# EAGLE design Main_Board (EAGLE 7.7.0)

## Sheet 1 of 5: Ethernet&CAN
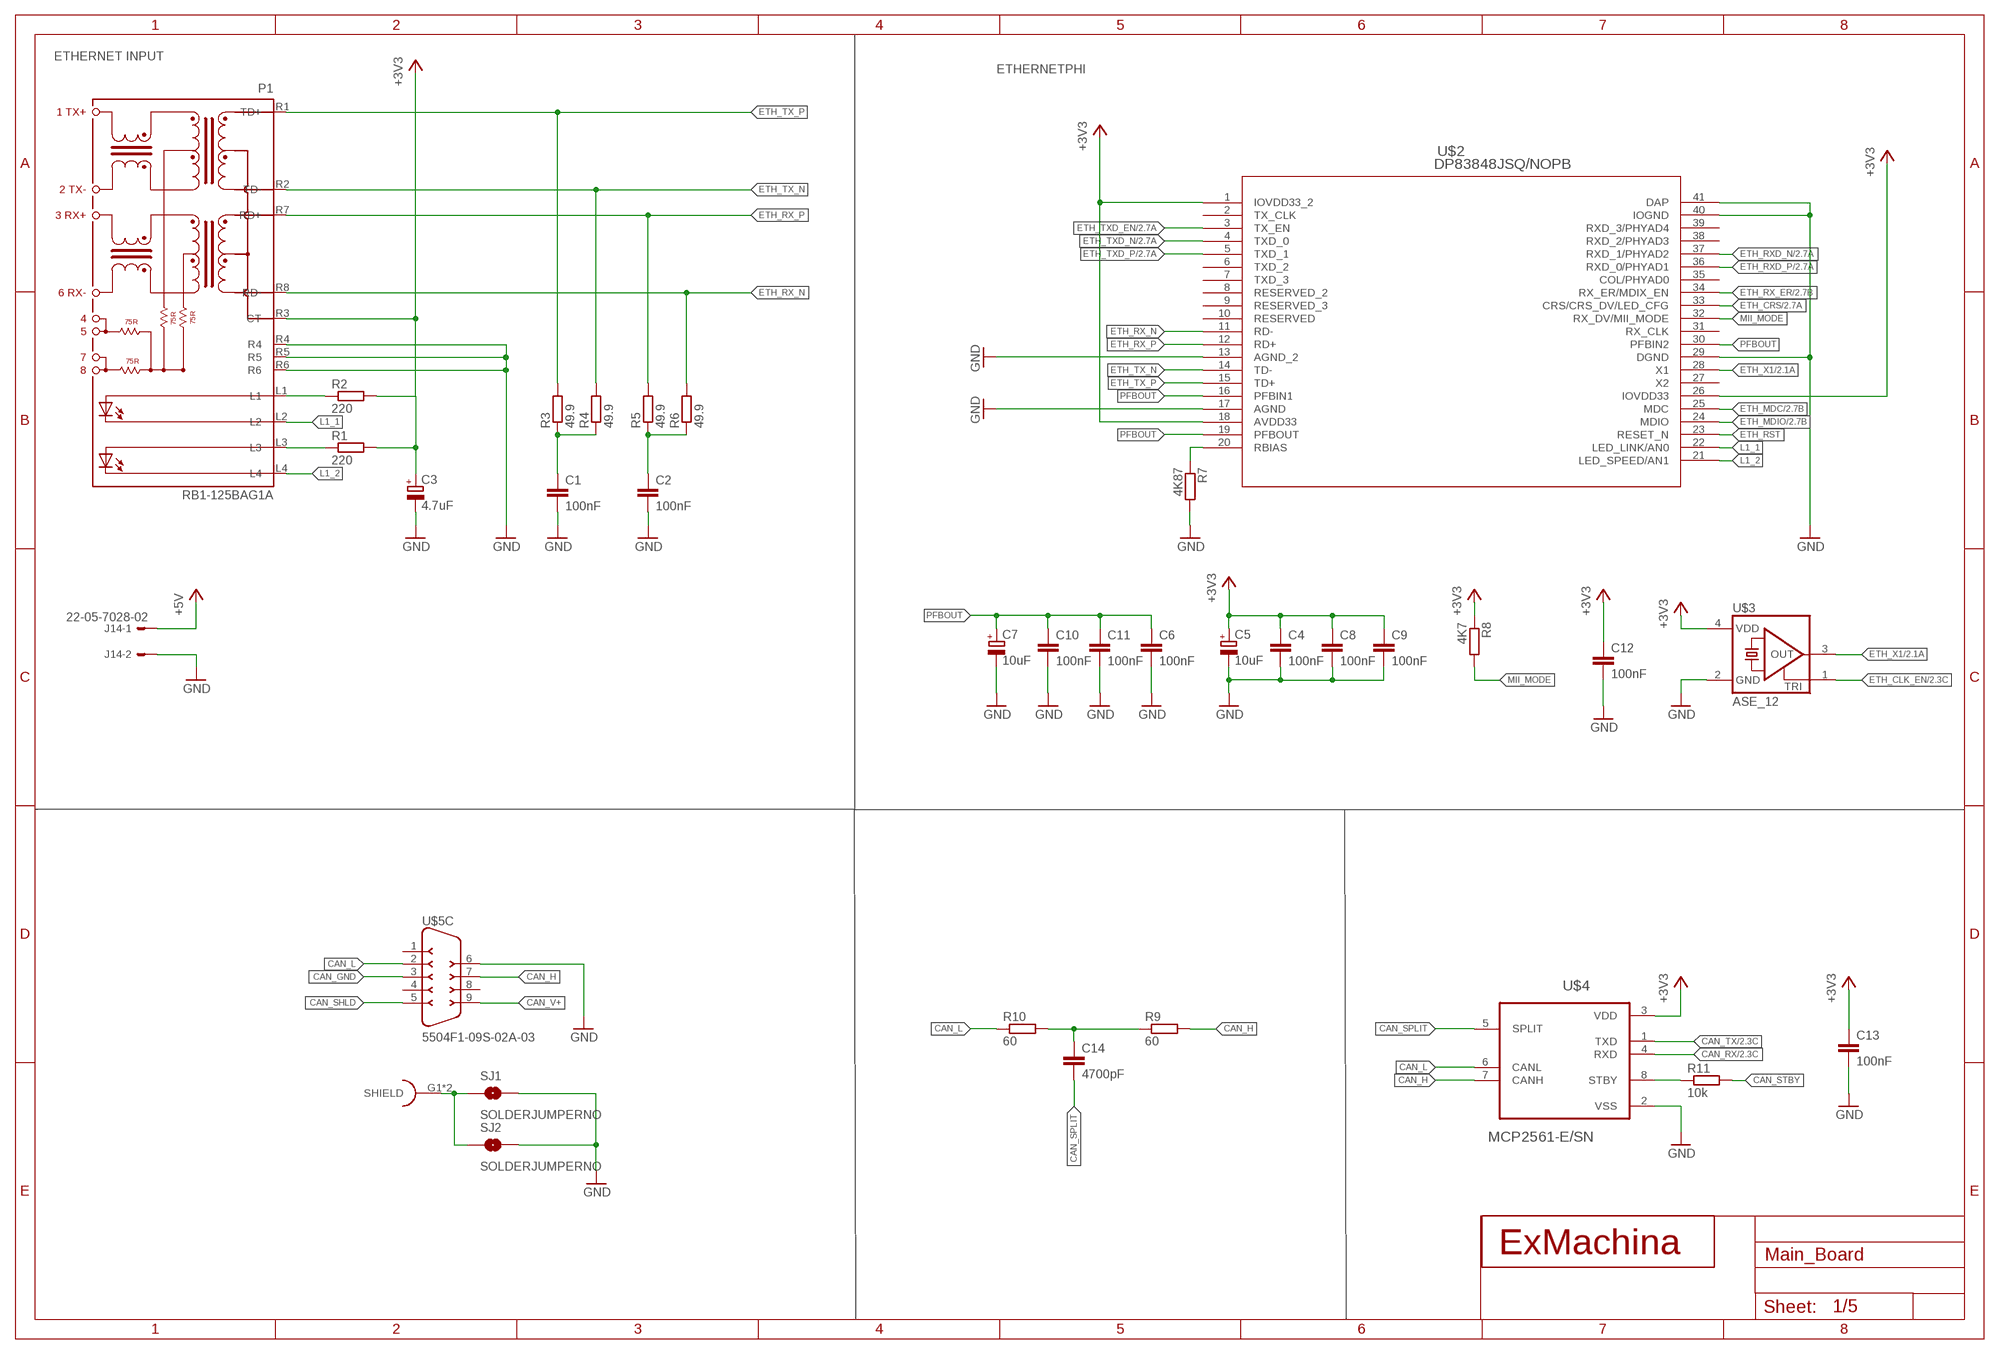
[diagram p0: schematic, sheet 1]

### Parts
C1  100nF  C-EUC0603  [C0603]
C2  100nF  C-EUC0603  [C0603]
C3  4.7uF  CPOL-EUCT3216  [CT3216]
C4  100nF  C-EUC0603  [C0603]
C5  10uF  CPOL-EUCT3216  [CT3216]
C6  100nF  C-EUC0603  [C0603]
C7  10uF  CPOL-EUCT3216  [CT3216]
C8  100nF  C-EUC0603  [C0603]
C9  100nF  C-EUC0603  [C0603]
C10  100nF  C-EUC0603  [C0603]
C11  100nF  C-EUC0603  [C0603]
C12  100nF  C-EUC0603  [C0603]
C13  100nF  C-EUC0603  [C0603]
C14  4700pF  C-EUC0603  [C0603]
J14  22-05-7028-02  [7395-02]
P1  RB1-125BAG1A  [WIZNET_RB1-125BAG1A]
R1  220  R-EU_R0603  [R0603]
R2  220  R-EU_R0603  [R0603]
R3  49.9  R-EU_R0603  [R0603]
R4  49.9  R-EU_R0603  [R0603]
R5  49.9  R-EU_R0603  [R0603]
R6  49.9  R-EU_R0603  [R0603]
R7  4K87  R-EU_R0603  [R0603]
R8  4K7  R-EU_R0603  [R0603]
R9  60  R-EU_R0603  [R0603]
R10  60  R-EU_R0603  [R0603]
R11  10k  R-EU_R0603  [R0603]
SJ1  SOLDERJUMPERNO  [SJ_2S-NO]
SJ2  SOLDERJUMPERNO  [SJ_2S-NO]
U$1  EXMACHINA-LOGO-NAME  [EXM-LOGO-BASELINE]
U$2  DP83848JSQ/NOPB  [SQA40B]
U$3  ASE_12  ASE  [ASE]
U$4  MCP2561-E/SN  [SOIC127P600X175-8N]
U$5  5504F1-09S-02A-03  [5504F1-09S-02A]

### Nets
+3V3 [supply]: C3.+ C4.1 C5.+ C8.1 C9.1 C12.1 C13.1 P1.R3(CT) R1.2 R2.2 R8.1 U$2.1(IOVDD33_2) U$2.18(AVDD33) U$2.26(IOVDD33) U$3.4(VDD) U$4.3(VDD) ; also sheet 2,3,4,5
+5V [supply]: J14.1 ; also sheet 3,4,5
CAN_GND: U$5.3
CAN_H [signal]: R9.2 U$4.7(CANH) U$5.7
CAN_L [signal]: R10.1 U$4.6(CANL) U$5.2
CAN_RX [signal]: U$4.4(RXD) ; also sheet 2
CAN_SHLD: U$5.5
CAN_SPLIT [signal]: C14.2 U$4.5(SPLIT)
CAN_STBY [signal]: R11.2
CAN_TX [signal]: U$4.1(TXD) ; also sheet 2
CAN_V+: U$5.9
ETH_CLK_EN [signal]: U$3.1(TRI) ; also sheet 2
ETH_CRS [signal]: U$2.33(CRS/CRS_DV/LED_CFG) ; also sheet 2
ETH_MDC [signal]: U$2.25(MDC) ; also sheet 2
ETH_MDIO [signal]: U$2.24(MDIO) ; also sheet 2
ETH_RST [signal]: U$2.23(RESET_N)
ETH_RX_ER [signal]: U$2.34(RX_ER/MDIX_EN) ; also sheet 2
ETH_RX_N [signal]: P1.R8(RD-) R6.2 U$2.11(RD-)
ETH_RX_P [signal]: P1.R7(RD+) R5.2 U$2.12(RD+)
ETH_RXD_N [signal]: U$2.37(RXD_1/PHYAD2) ; also sheet 2
ETH_RXD_P [signal]: U$2.36(RXD_0/PHYAD1) ; also sheet 2
ETH_TX_N [signal]: P1.R2(TD-) R4.2 U$2.14(TD-)
ETH_TX_P [signal]: P1.R1(TD+) R3.2 U$2.15(TD+)
ETH_TXD_EN [signal]: U$2.3(TX_EN) ; also sheet 2
ETH_TXD_N [signal]: U$2.4(TXD_0) ; also sheet 2
ETH_TXD_P [signal]: U$2.5(TXD_1) ; also sheet 2
ETH_X1 [signal]: U$2.28(X1) U$3.3(OUT) ; also sheet 2
GND [supply]: C1.2 C2.2 C3.- C4.2 C5.- C6.2 C7.- C8.2 C9.2 C10.2 C11.2 C12.2 C13.2 J14.2 P1.R4 P1.R5 P1.R6 R7.2 SJ1.2 SJ2.2 U$2.13(AGND_2) U$2.17(AGND) U$2.29(DGND) U$2.40(IOGND) U$2.41(DAP) U$3.2(GND) U$4.2(VSS) U$5.6 ; also sheet 2,3,4,5
L1_1 [signal]: P1.L2 U$2.22(LED_LINK/AN0)
L1_2 [signal]: P1.L4 U$2.21(LED_SPEED/AN1)
MII_MODE [signal]: R8.2 U$2.32(RX_DV/MII_MODE)
N$1: C1.1 R3.1 R4.1
N$2: C2.1 R5.1 R6.1
N$3: C14.1 R9.1 R10.2
N$4: R7.1 U$2.20(RBIAS)
N$5 [signal]: R11.1 U$4.8(STBY)
N$6: SJ1.1 SJ2.1 U$5.G1(S:SHIELD) U$5.G2(S:SHIELD)
N$8 [signal]: P1.L1 R2.1
N$9 [signal]: P1.L3 R1.1
PFBOUT [signal]: C6.1 C7.+ C10.1 C11.1 U$2.16(PFBIN1) U$2.19(PFBOUT) U$2.30(PFBIN2)
Unconnected: U$2.2(TX_CLK) U$2.6(TXD_2) U$2.7(TXD_3) U$2.8(RESERVED_2) U$2.9(RESERVED_3) U$2.10(RESERVED) U$2.27(X2) U$2.31(RX_CLK) U$2.35(COL/PHYAD0) U$2.38(RXD_2/PHYAD3) U$2.39(RXD_3/PHYAD4) U$5.1 U$5.4 U$5.8

### Notes on the sheet
- ETHERNET INPUT
- ETHERNETPHI

## Sheet 2 of 5: LPC1768 + EEPROM
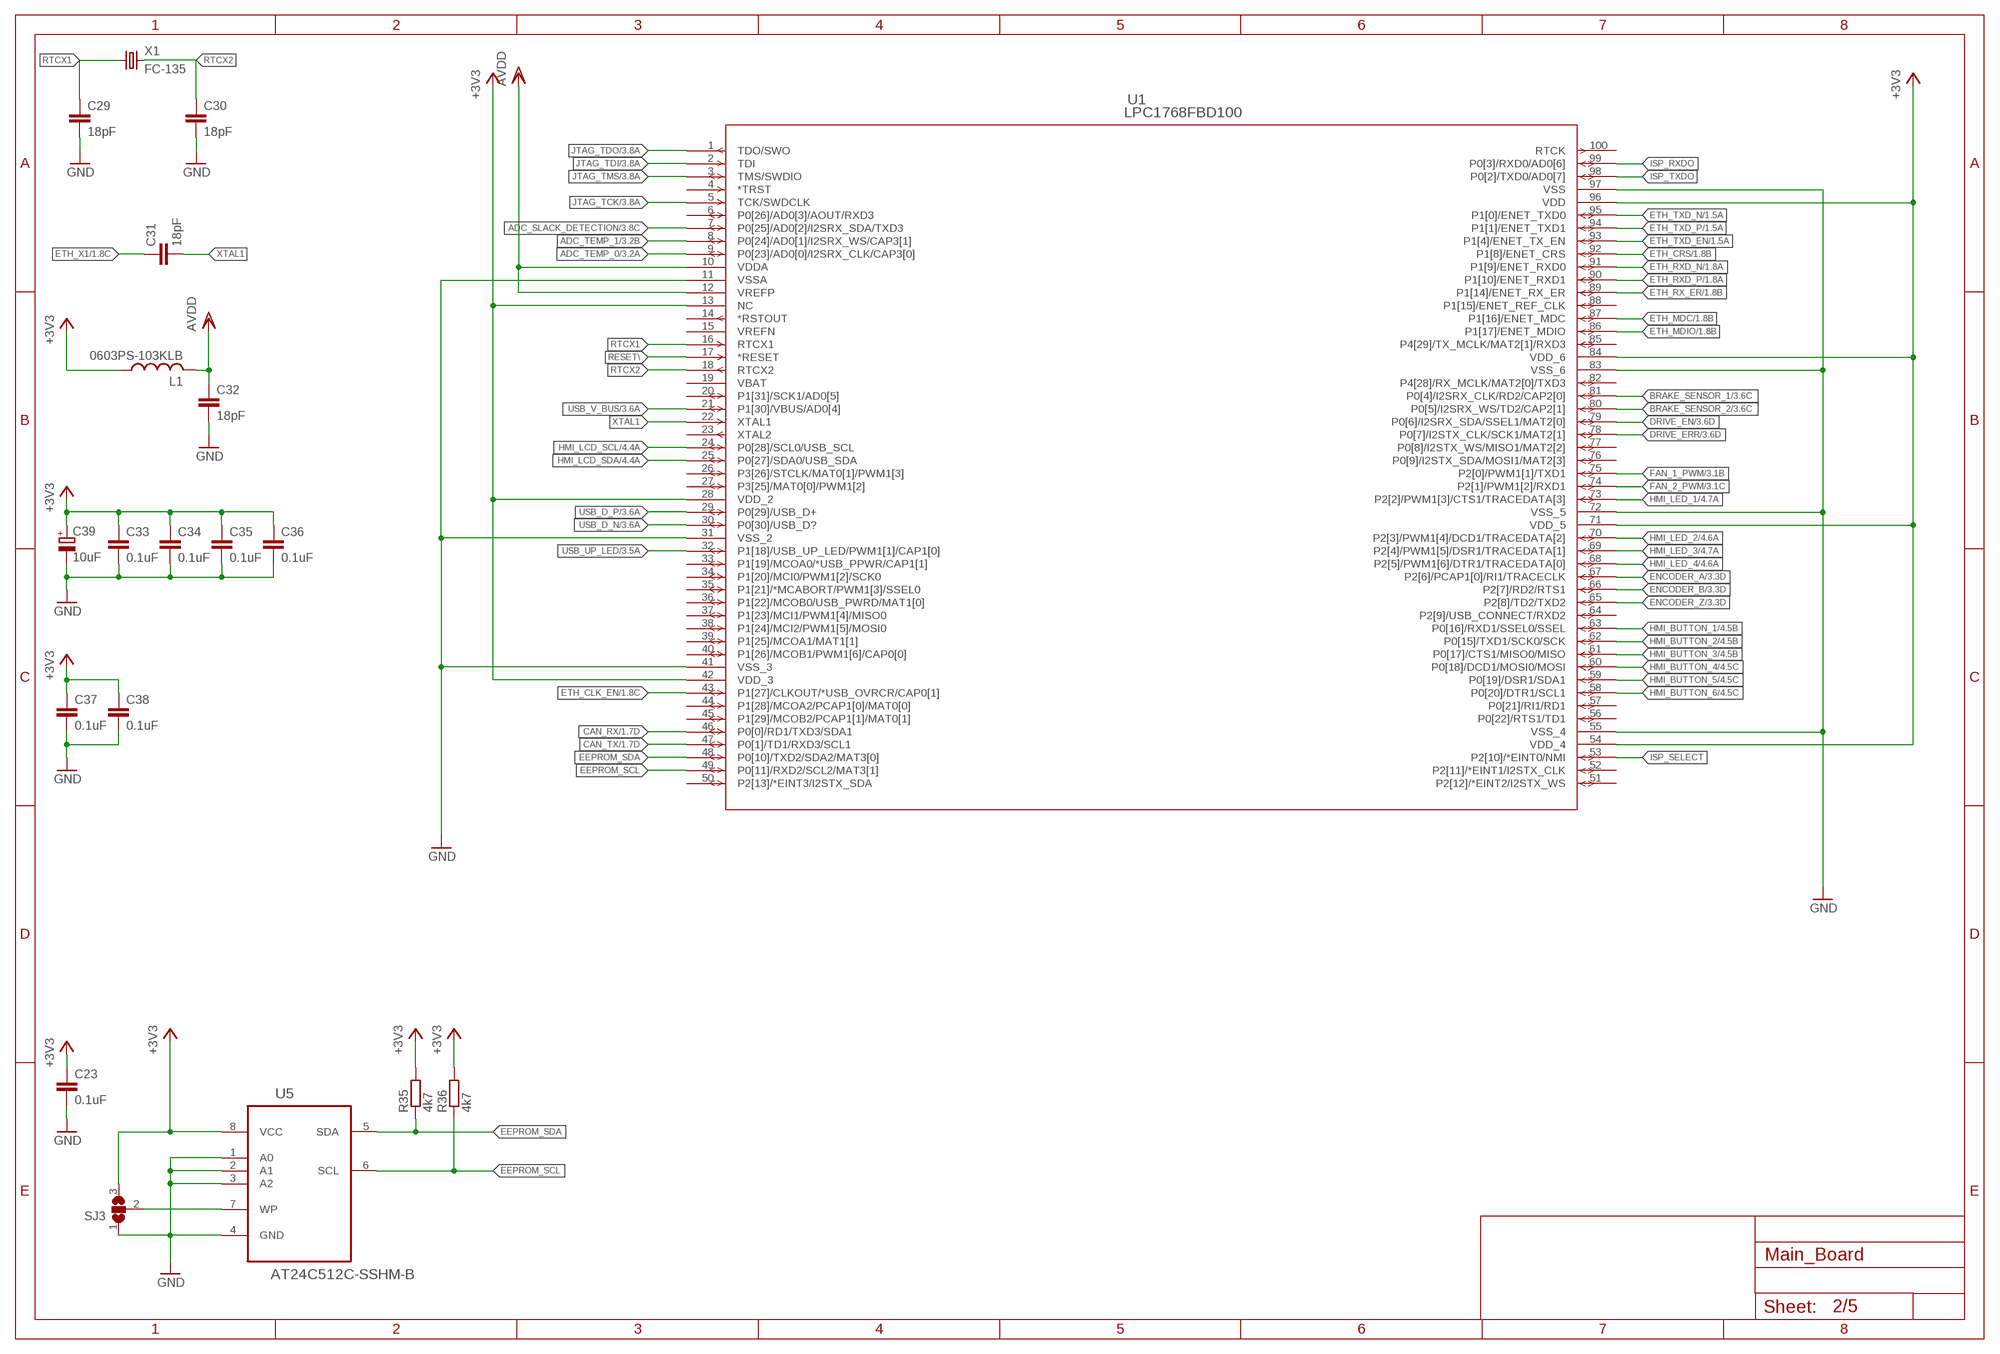
[diagram p1: schematic, sheet 2]

### Parts
C23  0.1uF  C-EUC0603  [C0603]
C29  18pF  C-EUC0603  [C0603]
C30  18pF  C-EUC0603  [C0603]
C31  18pF  C-EUC0603  [C0603]
C32  18pF  C-EUC0603  [C0603]
C33  0.1uF  C-EUC0603  [C0603]
C34  0.1uF  C-EUC0603  [C0603]
C35  0.1uF  C-EUC0603  [C0603]
C36  0.1uF  C-EUC0603  [C0603]
C37  0.1uF  C-EUC0603  [C0603]
C38  0.1uF  C-EUC0603  [C0603]
C39  10uF  CPOL-EUCT3216  [CT3216]
L1  0603PS-103KLB  0603PS  [0603]
R35  4k7  R-EU_R0603  [R0603]
R36  4k7  R-EU_R0603  [R0603]
SJ3  SJ2W  [SJ_2]
U1  LPC1768FBD100  [SOT407-1]
U5  AT24C512C-SSHM-B  [SOIC127P600X175-8N]
X1  FC-135  [FC-135]

### Nets
+3V3 [supply]: C23.1 C33.1 C34.1 C35.1 C36.1 C37.1 C38.1 C39.+ L1.P$1 R35.2 R36.2 SJ3.3 U1.13(NC) U1.28(VDD_2) U1.42(VDD_3) U1.54(VDD_4) U1.71(VDD_5) U1.84(VDD_6) U1.96(VDD) U5.8(VCC) ; also sheet 1,3,4,5
ADC_SLACK_DETECTION [signal]: U1.7(P0[25]/AD0[2]/I2SRX_SDA/TXD3) ; also sheet 3
ADC_TEMP_0 [signal]: U1.9(P0[23]/AD0[0]/I2SRX_CLK/CAP3[0]) ; also sheet 3
ADC_TEMP_1 [signal]: U1.8(P0[24]/AD0[1]/I2SRX_WS/CAP3[1]) ; also sheet 3
AVDD: C32.1 L1.P$2 U1.10(VDDA) U1.12(VREFP)
BRAKE_SENSOR_1: U1.81(P0[4]/I2SRX_CLK/RD2/CAP2[0]) ; also sheet 3
BRAKE_SENSOR_2: U1.80(P0[5]/I2SRX_WS/TD2/CAP2[1]) ; also sheet 3
CAN_RX [signal]: U1.46(P0[0]/RD1/TXD3/SDA1) ; also sheet 1
CAN_TX [signal]: U1.47(P0[1]/TD1/RXD3/SCL1) ; also sheet 1
DRIVE_EN: U1.79(P0[6]/I2SRX_SDA/SSEL1/MAT2[0]) ; also sheet 3
DRIVE_ERR: U1.78(P0[7]/I2STX_CLK/SCK1/MAT2[1]) ; also sheet 3
EEPROM_SCL: R36.1 U1.49(P0[11]/RXD2/SCL2/MAT3[1]) U5.6(SCL)
EEPROM_SDA: R35.1 U1.48(P0[10]/TXD2/SDA2/MAT3[0]) U5.5(SDA)
ENCODER_A: U1.67(P2[6]/PCAP1[0]/RI1/TRACECLK) ; also sheet 3
ENCODER_B: U1.66(P2[7]/RD2/RTS1) ; also sheet 3
ENCODER_Z: U1.65(P2[8]/TD2/TXD2) ; also sheet 3
ETH_CLK_EN [signal]: U1.43(P1[27]/CLKOUT/*USB_OVRCR/CAP0[1]) ; also sheet 1
ETH_CRS [signal]: U1.92(P1[8]/ENET_CRS) ; also sheet 1
ETH_MDC [signal]: U1.87(P1[16]/ENET_MDC) ; also sheet 1
ETH_MDIO [signal]: U1.86(P1[17]/ENET_MDIO) ; also sheet 1
ETH_RX_ER [signal]: U1.89(P1[14]/ENET_RX_ER) ; also sheet 1
ETH_RXD_N [signal]: U1.91(P1[9]/ENET_RXD0) ; also sheet 1
ETH_RXD_P [signal]: U1.90(P1[10]/ENET_RXD1) ; also sheet 1
ETH_TXD_EN [signal]: U1.93(P1[4]/ENET_TX_EN) ; also sheet 1
ETH_TXD_N [signal]: U1.95(P1[0]/ENET_TXD0) ; also sheet 1
ETH_TXD_P [signal]: U1.94(P1[1]/ENET_TXD1) ; also sheet 1
ETH_X1 [signal]: C31.1 ; also sheet 1
FAN_1_PWM [signal]: U1.75(P2[0]/PWM1[1]/TXD1) ; also sheet 3
FAN_2_PWM [signal]: U1.74(P2[1]/PWM1[2]/RXD1) ; also sheet 3
GND [supply]: C23.2 C29.2 C30.2 C32.2 C33.2 C34.2 C35.2 C36.2 C37.2 C38.2 C39.- SJ3.1 U1.11(VSSA) U1.31(VSS_2) U1.41(VSS_3) U1.55(VSS_4) U1.72(VSS_5) U1.83(VSS_6) U1.97(VSS) U5.1(A0) U5.2(A1) U5.3(A2) U5.4(GND) ; also sheet 1,3,4,5
HMI_BUTTON_1 [signal]: U1.63(P0[16]/RXD1/SSEL0/SSEL) ; also sheet 4
HMI_BUTTON_2 [signal]: U1.62(P0[15]/TXD1/SCK0/SCK) ; also sheet 4
HMI_BUTTON_3 [signal]: U1.61(P0[17]/CTS1/MISO0/MISO) ; also sheet 4
HMI_BUTTON_4 [signal]: U1.60(P0[18]/DCD1/MOSI0/MOSI) ; also sheet 4
HMI_BUTTON_5 [signal]: U1.59(P0[19]/DSR1/SDA1) ; also sheet 4
HMI_BUTTON_6: U1.58(P0[20]/DTR1/SCL1) ; also sheet 4
HMI_LCD_SCL [signal]: U1.24(P0[28]/SCL0/USB_SCL) ; also sheet 4
HMI_LCD_SDA [signal]: U1.25(P0[27]/SDA0/USB_SDA) ; also sheet 4
HMI_LED_1 [signal]: U1.73(P2[2]/PWM1[3]/CTS1/TRACEDATA[3]) ; also sheet 4
HMI_LED_2 [signal]: U1.70(P2[3]/PWM1[4]/DCD1/TRACEDATA[2]) ; also sheet 4
HMI_LED_3 [signal]: U1.69(P2[4]/PWM1[5]/DSR1/TRACEDATA[1]) ; also sheet 4
HMI_LED_4 [signal]: U1.68(P2[5]/PWM1[6]/DTR1/TRACEDATA[0]) ; also sheet 4
ISP_RXDO [signal]: U1.99(P0[3]/RXD0/AD0[6])
ISP_SELECT [signal]: U1.53(P2[10]/*EINT0/NMI)
ISP_TXDO [signal]: U1.98(P0[2]/TXD0/AD0[7])
JTAG_TCK [signal]: U1.5(TCK/SWDCLK) ; also sheet 3
JTAG_TDI [signal]: U1.2(TDI) ; also sheet 3
JTAG_TDO [signal]: U1.1(TDO/SWO) ; also sheet 3
JTAG_TMS [signal]: U1.3(TMS/SWDIO) ; also sheet 3
N$22: SJ3.2 U5.7(WP)
RESET\ [signal]: U1.17(*RESET)
RTCX1: C29.1 U1.16(RTCX1) X1.1
RTCX2: C30.1 U1.18(RTCX2) X1.2
USB_D_N [signal]: U1.30(P0[30]/USB_D?) ; also sheet 3
USB_D_P [signal]: U1.29(P0[29]/USB_D+) ; also sheet 3
USB_UP_LED [signal]: U1.32(P1[18]/USB_UP_LED/PWM1[1]/CAP1[0]) ; also sheet 3
USB_V_BUS [signal]: U1.21(P1[30]/VBUS/AD0[4]) ; also sheet 3
XTAL1: C31.2 U1.22(XTAL1)
Unconnected: U1.4(*TRST) U1.6(P0[26]/AD0[3]/AOUT/RXD3) U1.14(*RSTOUT) U1.20(P1[31]/SCK1/AD0[5]) U1.23(XTAL2) U1.26(P3[26]/STCLK/MAT0[1]/PWM1[3]) U1.27(P3[25]/MAT0[0]/PWM1[2]) U1.33(P1[19]/MCOA0/*USB_PPWR/CAP1[1]) U1.34(P1[20]/MCI0/PWM1[2]/SCK0) U1.35(P1[21]/*MCABORT/PWM1[3]/SSEL0) U1.36(P1[22]/MCOB0/USB_PWRD/MAT1[0]) U1.37(P1[23]/MCI1/PWM1[4]/MISO0) U1.38(P1[24]/MCI2/PWM1[5]/MOSI0) U1.39(P1[25]/MCOA1/MAT1[1]) U1.40(P1[26]/MCOB1/PWM1[6]/CAP0[0]) U1.44(P1[28]/MCOA2/PCAP1[0]/MAT0[0]) U1.45(P1[29]/MCOB2/PCAP1[1]/MAT0[1]) U1.50(P2[13]/*EINT3/I2STX_SDA) U1.51(P2[12]/*EINT2/I2STX_WS) U1.52(P2[11]/*EINT1/I2STX_CLK) U1.56(P0[22]/RTS1/TD1) U1.57(P0[21]/RI1/RD1) U1.64(P2[9]/USB_CONNECT/RXD2) U1.76(P0[9]/I2STX_SDA/MOSI1/MAT2[3]) U1.77(P0[8]/I2STX_WS/MISO1/MAT2[2]) U1.82(P4[28]/RX_MCLK/MAT2[0]/TXD3) U1.85(P4[29]/TX_MCLK/MAT2[1]/RXD3) U1.88(P1[15]/ENET_REF_CLK) U1.100(RTCK)

## Sheet 3 of 5: Motor Sensors
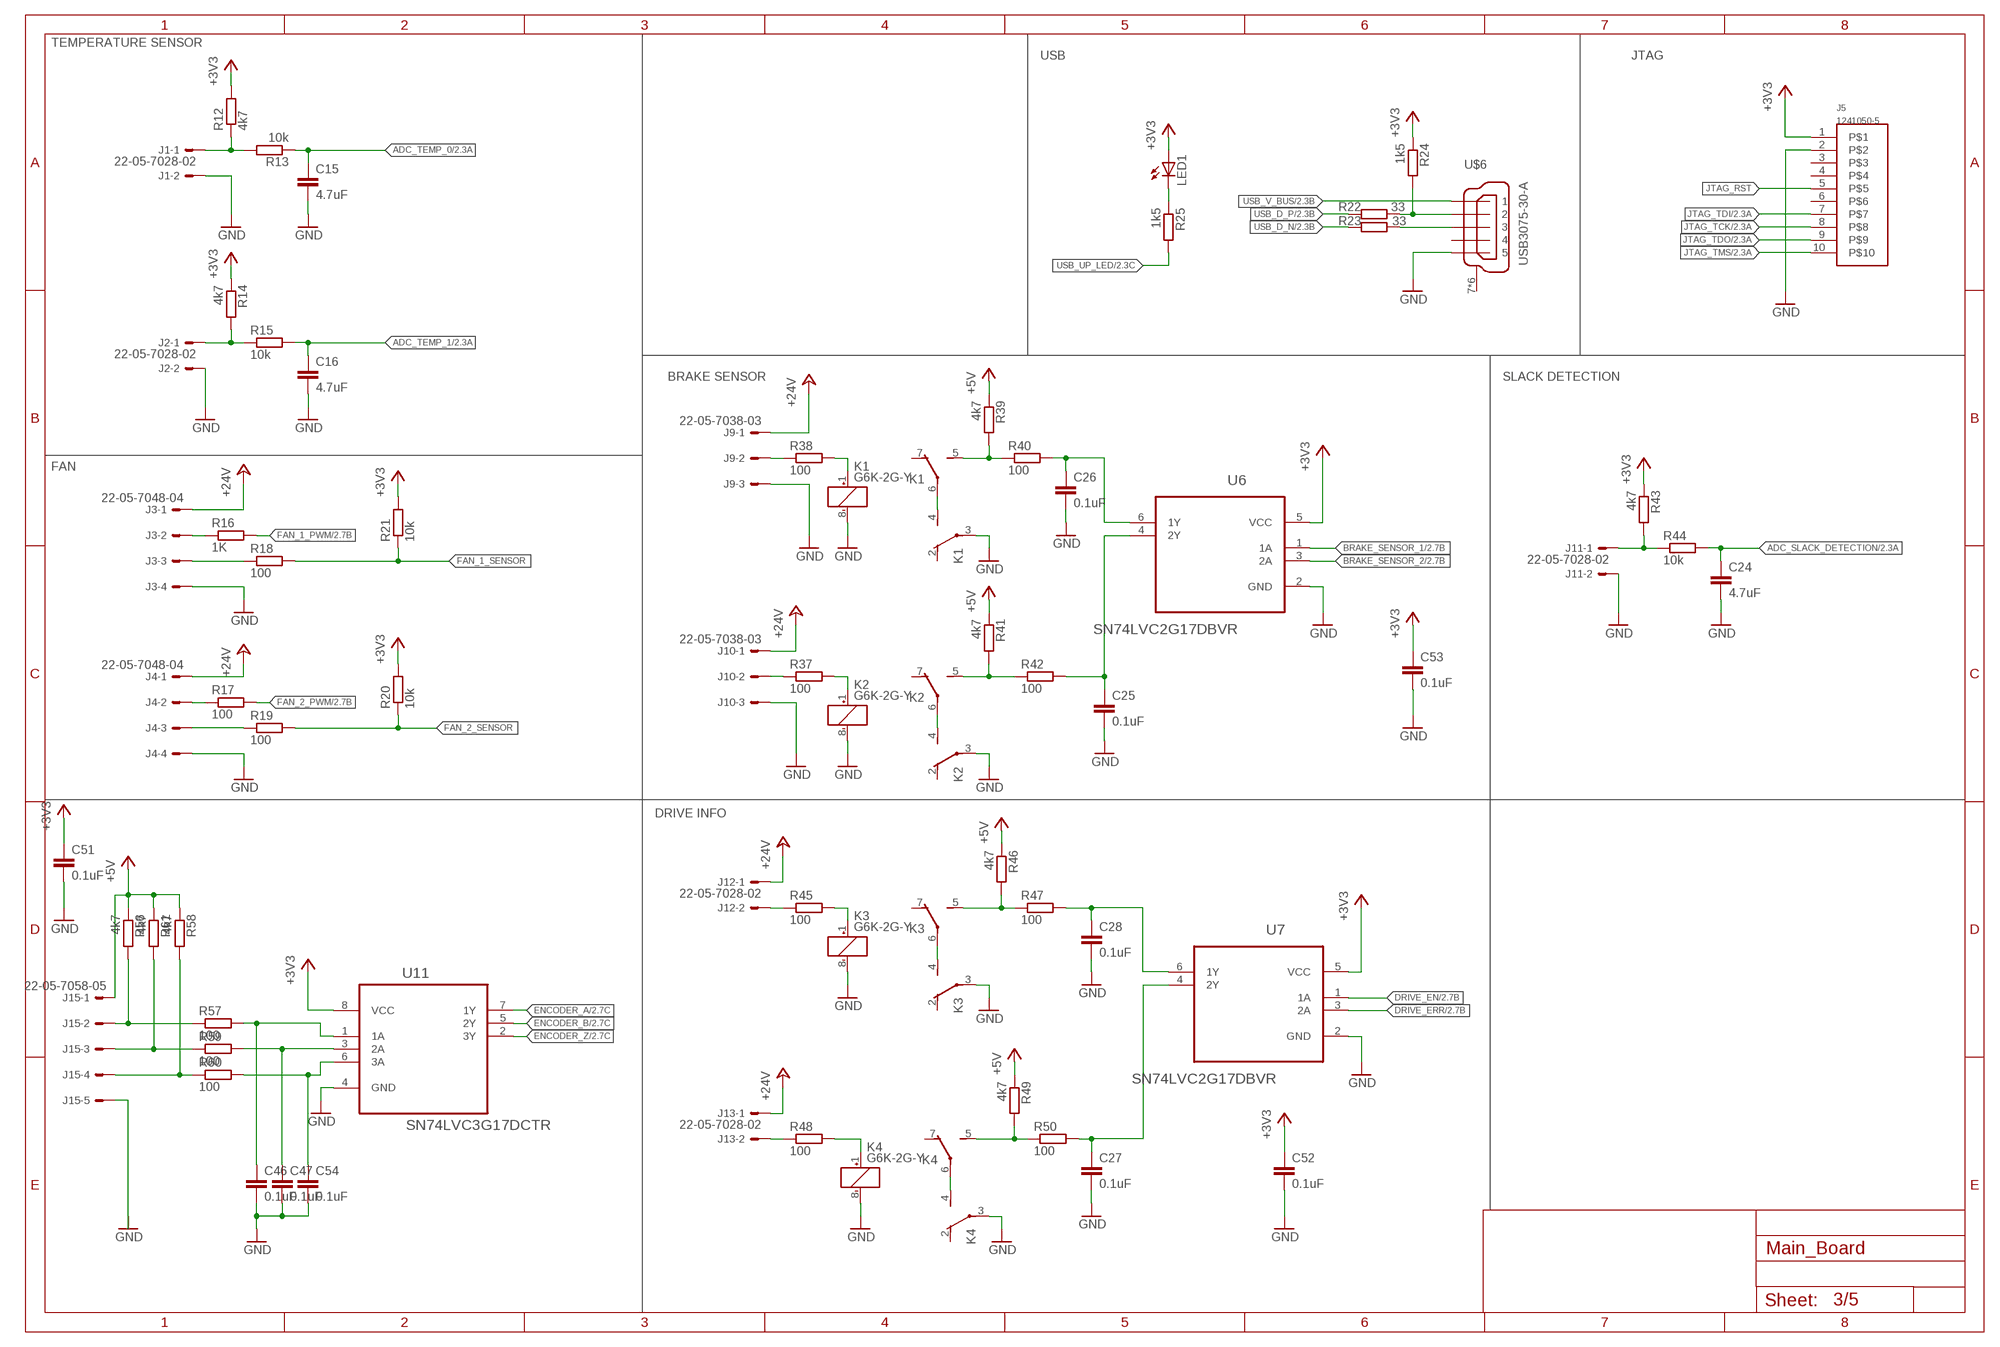
[diagram p2: schematic, sheet 3]

### Parts
C15  4.7uF  C-EUC0603  [C0603]
C16  4.7uF  C-EUC0603  [C0603]
C24  4.7uF  C-EUC0603  [C0603]
C25  0.1uF  C-EUC0603  [C0603]
C26  0.1uF  C-EUC0603  [C0603]
C27  0.1uF  C-EUC0603  [C0603]
C28  0.1uF  C-EUC0603  [C0603]
C46  0.1uF  C-EUC0603  [C0603]
C47  0.1uF  C-EUC0603  [C0603]
C51  0.1uF  C-EUC0603  [C0603]
C52  0.1uF  C-EUC0603  [C0603]
C53  0.1uF  C-EUC0603  [C0603]
C54  0.1uF  C-EUC0603  [C0603]
J1  22-05-7028-02  [7395-02]
J2  22-05-7028-02  [7395-02]
J3  22-05-7048-04  [7395-04]
J4  22-05-7048-04  [7395-04]
J5  1241050-5  [2.54/2X5]
J9  22-05-7038-03  [7395-03]
J10  22-05-7038-03  [7395-03]
J11  22-05-7028-02  [7395-02]
J12  22-05-7028-02  [7395-02]
J13  22-05-7028-02  [7395-02]
J15  22-05-7058-05  [7395-05]
K1  G6K-2G-Y  [G6K-2G-Y]
K2  G6K-2G-Y  [G6K-2G-Y]
K3  G6K-2G-Y  [G6K-2G-Y]
K4  G6K-2G-Y  [G6K-2G-Y]
LED1  LEDCHIPLED_0603  [CHIPLED_0603]
R12  4k7  R-EU_R0603  [R0603]
R13  10k  R-EU_R0603  [R0603]
R14  4k7  R-EU_R0603  [R0603]
R15  10k  R-EU_R0603  [R0603]
R16  1K  R-EU_R0603  [R0603]
R17  100  R-EU_R0603  [R0603]
R18  100  R-EU_R0603  [R0603]
R19  100  R-EU_R0603  [R0603]
R20  10k  R-EU_R0603  [R0603]
R21  10k  R-EU_R0603  [R0603]
R22  33  R-EU_R0603  [R0603]
R23  33  R-EU_R0603  [R0603]
R24  1k5  R-EU_R0603  [R0603]
R25  1k5  R-EU_R0603  [R0603]
R37  100  R-EU_R0603  [R0603]
R38  100  R-EU_R0603  [R0603]
R39  4k7  R-EU_R0603  [R0603]
R40  100  R-EU_R0603  [R0603]
R41  4k7  R-EU_R0603  [R0603]
R42  100  R-EU_R0603  [R0603]
R43  4k7  R-EU_R0603  [R0603]
R44  10k  R-EU_R0603  [R0603]
R45  100  R-EU_R0603  [R0603]
R46  4k7  R-EU_R0603  [R0603]
R47  100  R-EU_R0603  [R0603]
R48  100  R-EU_R0603  [R0603]
R49  4k7  R-EU_R0603  [R0603]
R50  100  R-EU_R0603  [R0603]
R56  4k7  R-EU_R0603  [R0603]
R57  100  R-EU_R0603  [R0603]
R58  4k7  R-EU_R0603  [R0603]
R59  100  R-EU_R0603  [R0603]
R60  100  R-EU_R0603  [R0603]
R61  4k7  R-EU_R0603  [R0603]
U6  SN74LVC2G17DBVR  [SOT95P280X145-6N]
U7  SN74LVC2G17DBVR  [SOT95P280X145-6N]
U11  SN74LVC3G17DCTR  [SOP65P400X130-8N]
U$6  USB3075-30-A  [USB_MICROB_SMT]

### Nets
+3V3 [supply]: C51.1 C52.1 C53.1 J5.1 LED1.A R12.2 R14.1 R20.2 R21.2 R24.1 R43.1 U6.5(VCC) U7.5(VCC) U11.8(VCC) ; also sheet 1,2,4,5
+5V [supply]: J15.1 R39.1 R41.1 R46.1 R49.1 R56.1 R58.1 R61.1 ; also sheet 1,4,5
+24V: J3.1 J4.1 J9.1 J10.1 J12.1 J13.1 ; also sheet 5
ADC_SLACK_DETECTION [signal]: C24.1 R44.2 ; also sheet 2
ADC_TEMP_0 [signal]: C15.1 R13.1 ; also sheet 2
ADC_TEMP_1 [signal]: C16.1 R15.2 ; also sheet 2
BRAKE_SENSOR_1: U6.1(1A) ; also sheet 2
BRAKE_SENSOR_2: U6.3(2A) ; also sheet 2
DRIVE_EN: U7.1(1A) ; also sheet 2
DRIVE_ERR: U7.3(2A) ; also sheet 2
ENCODER_A: U11.7(1Y) ; also sheet 2
ENCODER_B: U11.5(2Y) ; also sheet 2
ENCODER_Z: U11.2(3Y) ; also sheet 2
FAN_1_PWM [signal]: R16.2 ; also sheet 2
FAN_1_SENSOR [signal]: R18.2 R21.1
FAN_2_PWM [signal]: R17.2 ; also sheet 2
FAN_2_SENSOR [signal]: R19.2 R20.1
GND [supply]: C15.2 C16.2 C24.2 C25.2 C26.2 C27.2 C28.2 C46.2 C47.2 C51.2 C52.2 C53.2 C54.2 J1.2 J2.2 J3.4 J4.4 J5.2 J9.3 J10.3 J11.2 K1.3(2:P) K1.8(1:-) K2.3(2:P) K2.8(1:-) K3.3(2:P) K3.8(1:-) K4.3(2:P) K4.8(1:-) U6.2(GND) U7.2(GND) U11.4(GND) U$6.5 ; also sheet 1,2,4,5
JTAG_RST [signal]: J5.5
JTAG_TCK [signal]: J5.8 ; also sheet 2
JTAG_TDI [signal]: J5.7 ; also sheet 2
JTAG_TDO [signal]: J5.9 ; also sheet 2
JTAG_TMS [signal]: J5.10 ; also sheet 2
N$7 [signal]: J2.1 R14.2 R15.1
N$10 [signal]: J1.1 R12.1 R13.2
N$11 [signal]: J3.2 R16.1
N$12 [signal]: J4.3 R19.1
N$13 [signal]: J4.2 R17.1
N$14 [signal]: J3.3 R18.1
N$15 [signal]: R22.1 R24.2 U$6.2
N$16 [signal]: R23.1 U$6.3
N$18 [signal]: LED1.C R25.1
N$21: J9.2 R38.1
N$23: J10.2 R37.1
N$24: K1.1(1:+) R38.2
N$28: K3.1(1:+) R45.2
N$29: K1.4(2:S) K1.6(3:P)
N$30: K2.5(3:S) R41.2 R42.1
N$31 [signal]: J11.1 R43.2 R44.1
N$32: J12.2 R45.1
N$33: K4.1(1:+) R48.2
N$34: K3.5(3:S) R46.2 R47.1
N$35: J15.2 R56.2 R57.1
N$36: K4.5(3:S) R49.2 R50.1
N$37: J13.2 R48.1
N$38: C25.1 R42.2 U6.4(2Y)
N$39: C26.1 R40.2 U6.6(1Y)
N$40: J15.3 R59.1 R61.2
N$41: C28.1 R47.2 U7.6(1Y)
N$42: C27.1 R50.2 U7.4(2Y)
N$46: J15.4 R58.2 R60.1
N$52: C54.1 R60.2 U11.6(3A)
N$53: C47.1 R59.2 U11.3(2A)
N$54: C46.1 R57.2 U11.1(1A)
N$55: K2.1(1:+) R37.2
N$57: K2.4(2:S) K2.6(3:P)
N$58: K1.5(3:S) R39.2 R40.1
N$59: K4.4(2:S) K4.6(3:P)
N$60: K3.4(2:S) K3.6(3:P)
N$62: J15.5
USB_D_N [signal]: R23.2 ; also sheet 2
USB_D_P [signal]: R22.2 ; also sheet 2
USB_UP_LED [signal]: R25.2 ; also sheet 2
USB_V_BUS [signal]: U$6.1 ; also sheet 2
Unconnected: J5.3 J5.4 J5.6 K1.2(2:O) K1.7(3:O) K2.2(2:O) K2.7(3:O) K3.2(2:O) K3.7(3:O) K4.2(2:O) K4.7(3:O) U$6.4 U$6.7(S) U$6.8(S) U$6.9(S) U$6.10(S) U$6.11(S) U$6.12(S)

### Notes on the sheet
- TEMPERATURE SENSOR
- USB | JTAG
- BRAKE SENSOR | SLACK DETECTION
- FAN
- DRIVE INFO

## Sheet 4 of 5: HMI Interface
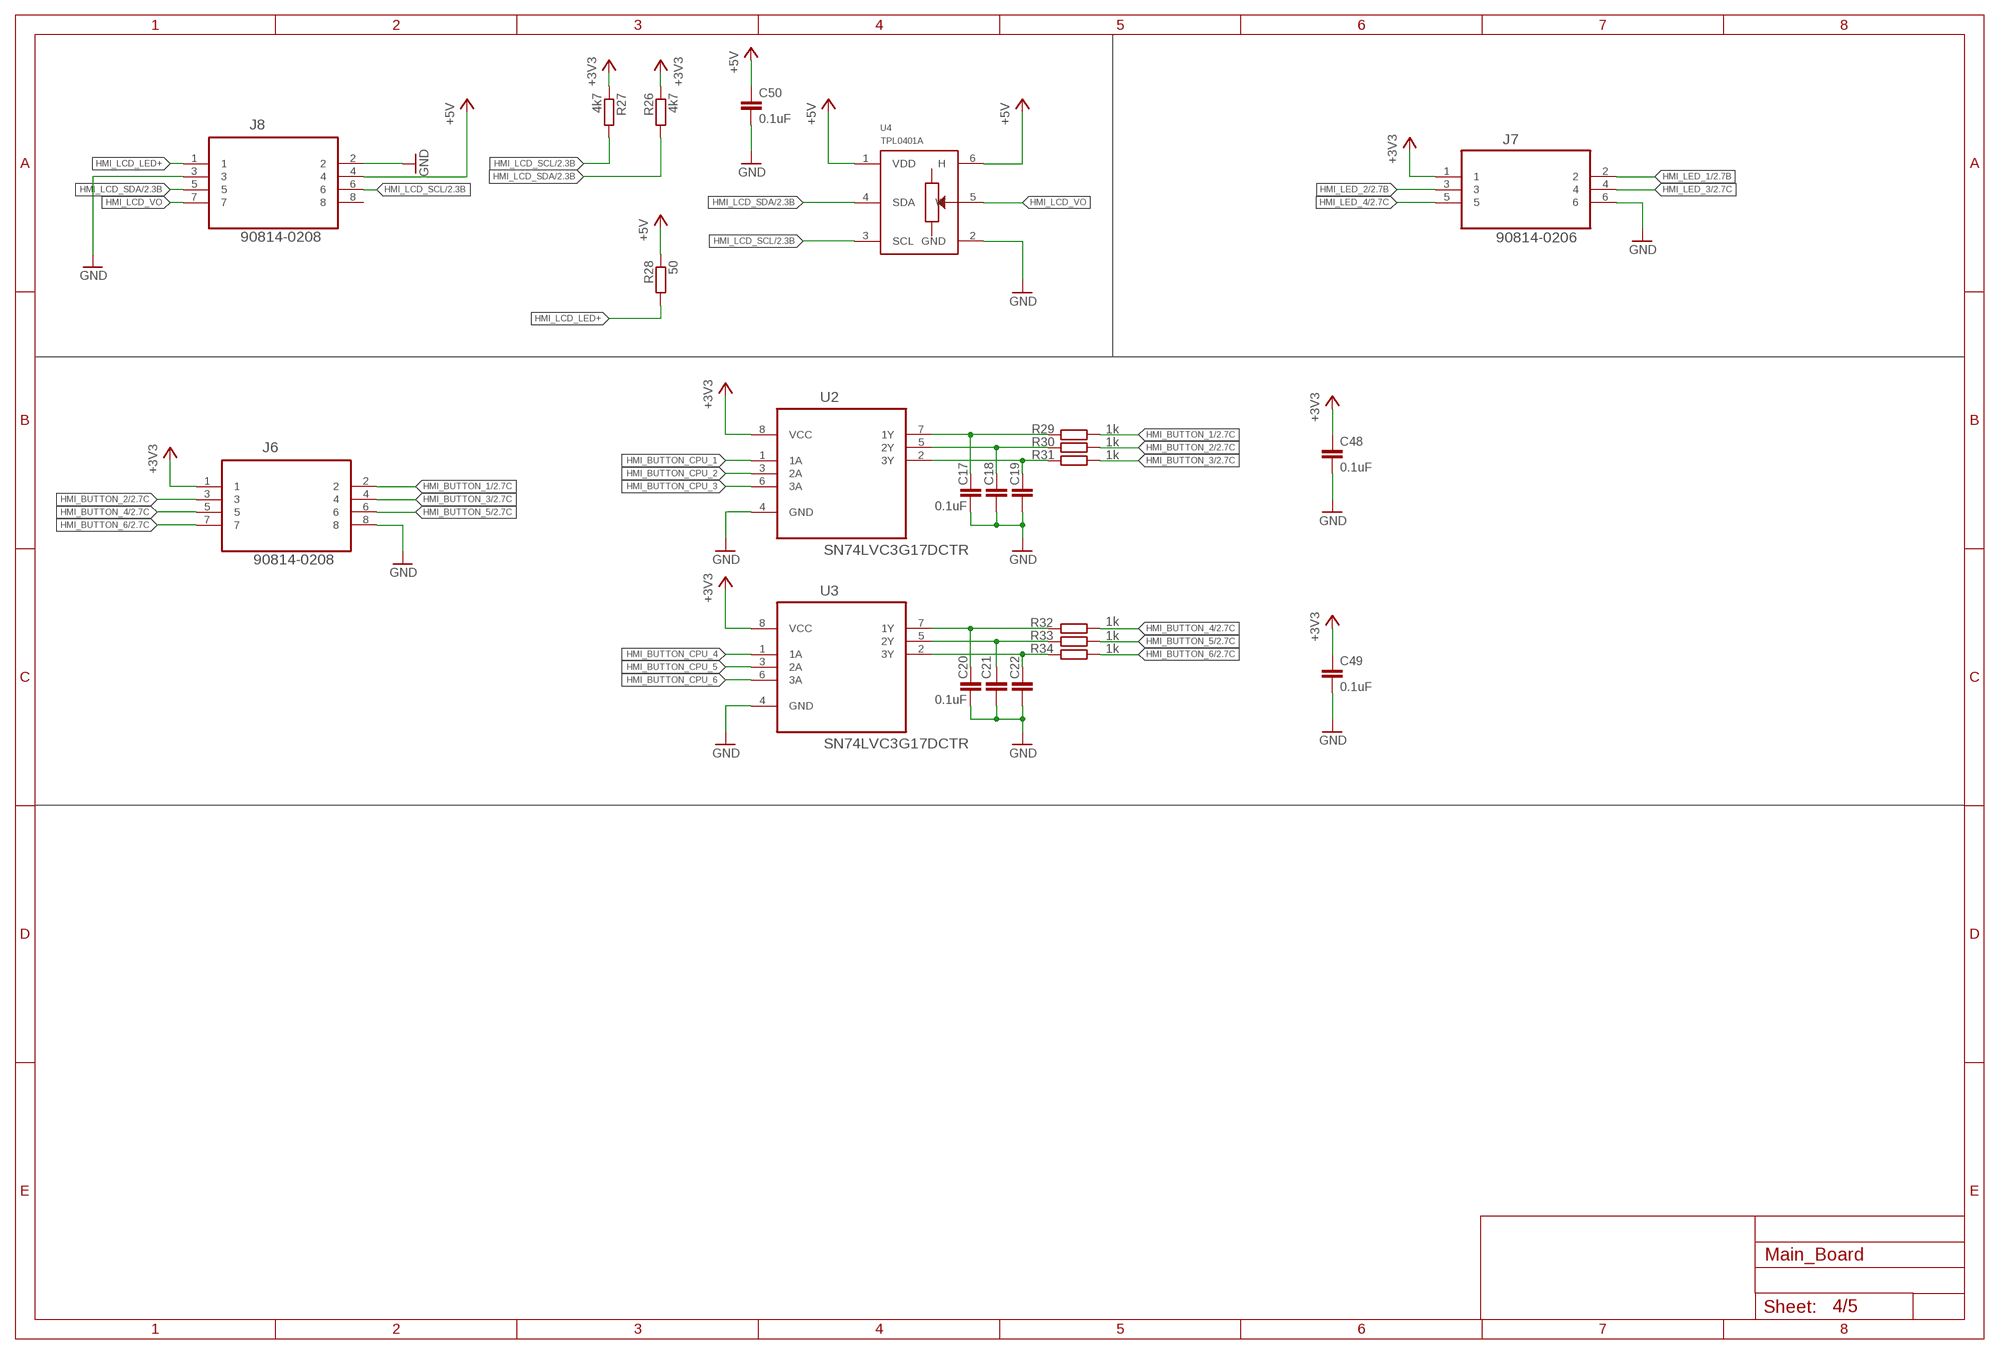
[diagram p3: schematic, sheet 4]

### Parts
C17  0.1uF  C-EUC0603  [C0603]
C18  0.1uF  C-EUC0603  [C0603]
C19  0.1uF  C-EUC0603  [C0603]
C20  0.1uF  C-EUC0603  [C0603]
C21  0.1uF  C-EUC0603  [C0603]
C22  0.1uF  C-EUC0603  [C0603]
C48  0.1uF  C-EUC0603  [C0603]
C49  0.1uF  C-EUC0603  [C0603]
C50  0.1uF  C-EUC0603  [C0603]
J6  90814-0208  [MOLEX_90814-0208]
J7  90814-0206  [MOLEX_90814-0206]
J8  90814-0208  [MOLEX_90814-0208]
R26  4k7  R-EU_R0603  [R0603]
R27  4k7  R-EU_R0603  [R0603]
R28  50  R-EU_R0603  [R0603]
R29  1k  R-EU_R0603  [R0603]
R30  1k  R-EU_R0603  [R0603]
R31  1k  R-EU_R0603  [R0603]
R32  1k  R-EU_R0603  [R0603]
R33  1k  R-EU_R0603  [R0603]
R34  1k  R-EU_R0603  [R0603]
U2  SN74LVC3G17DCTR  [SOP65P400X130-8N]
U3  SN74LVC3G17DCTR  [SOP65P400X130-8N]
U4  TPL0401A  [SC-70-DCK]

### Nets
+3V3 [supply]: C48.1 C49.1 J6.1 J7.1 R26.1 R27.1 U2.8(VCC) U3.8(VCC) ; also sheet 1,2,3,5
+5V [supply]: C50.1 J8.4 R28.1 U4.1(VDD) U4.6(H) ; also sheet 1,3,5
GND [supply]: C17.2 C18.2 C19.2 C20.2 C21.2 C22.2 C48.2 C49.2 C50.2 J6.8 J7.6 J8.2 J8.3 U2.4(GND) U3.4(GND) U4.2(GND) ; also sheet 1,2,3,5
HMI_BUTTON_1 [signal]: J6.2 R29.1 ; also sheet 2
HMI_BUTTON_2 [signal]: J6.3 R30.1 ; also sheet 2
HMI_BUTTON_3 [signal]: J6.4 R31.1 ; also sheet 2
HMI_BUTTON_4 [signal]: J6.5 R32.1 ; also sheet 2
HMI_BUTTON_5 [signal]: J6.6 R33.1 ; also sheet 2
HMI_BUTTON_6: J6.7 R34.1 ; also sheet 2
HMI_BUTTON_CPU_1: U2.1(1A)
HMI_BUTTON_CPU_2: U2.3(2A)
HMI_BUTTON_CPU_3: U2.6(3A)
HMI_BUTTON_CPU_4: U3.1(1A)
HMI_BUTTON_CPU_5: U3.3(2A)
HMI_BUTTON_CPU_6: U3.6(3A)
HMI_LCD_LED+: J8.1 R28.2
HMI_LCD_SCL [signal]: J8.6 R27.2 U4.3(SCL) ; also sheet 2
HMI_LCD_SDA [signal]: J8.5 R26.2 U4.4(SDA) ; also sheet 2
HMI_LCD_VO: J8.7 U4.5(W)
HMI_LED_1 [signal]: J7.2 ; also sheet 2
HMI_LED_2 [signal]: J7.3 ; also sheet 2
HMI_LED_3 [signal]: J7.4 ; also sheet 2
HMI_LED_4 [signal]: J7.5 ; also sheet 2
N$17: C17.1 R29.2 U2.7(1Y)
N$19: C18.1 R30.2 U2.5(2Y)
N$20: C19.1 R31.2 U2.2(3Y)
N$25: C20.1 R32.2 U3.7(1Y)
N$26: C21.1 R33.2 U3.5(2Y)
N$27: C22.1 R34.2 U3.2(3Y)
Unconnected: J8.8

## Sheet 5 of 5: Power
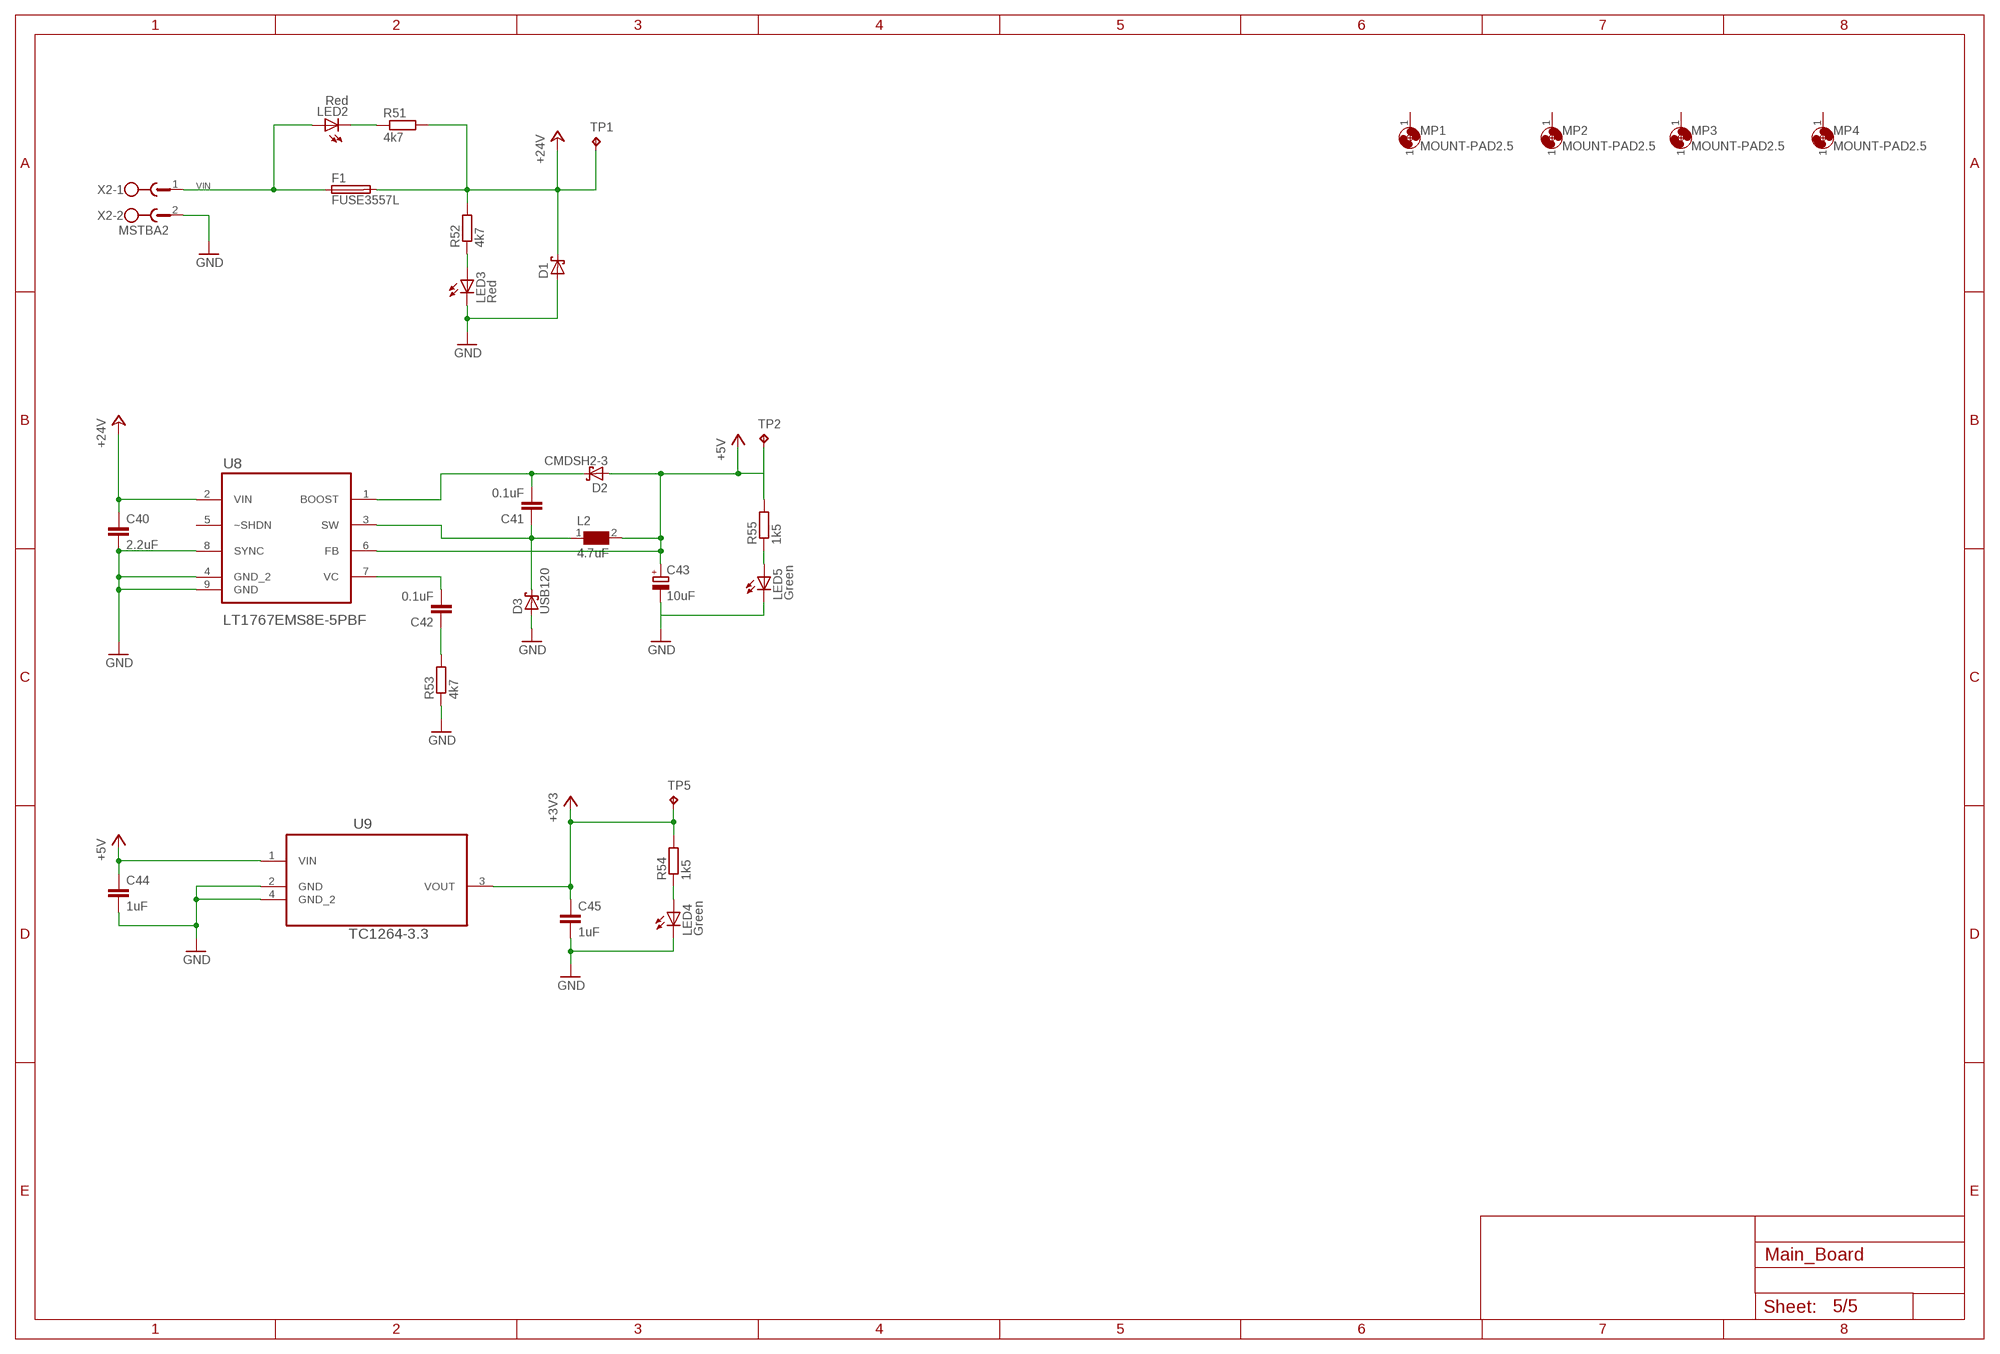
[diagram p4: schematic, sheet 5]

### Parts
C40  2.2uF  C-EUC0603  [C0603]
C41  0.1uF  C-EUC0603  [C0603]
C42  0.1uF  C-EUC0603  [C0603]
C43  10uF  CPOL-EUCT3216  [CT3216]
C44  1uF  C-EUC0603  [C0603]
C45  1uF  C-EUC0603  [C0603]
D1  STPS3L40UF  [SMB]
D2  CMDSH2-3  [SOD323-W]
D3  USB120  [DO216AA]
F1  FUSE3557L  [3557-LITTLE]
L2  4.7uF  WE-PD-7447713047_1030/1050  [WE-PD_1030/1050]
LED2  Red  LEDCHIPLED_0603  [CHIPLED_0603]
LED3  Red  LEDCHIPLED_0603  [CHIPLED_0603]
LED4  Green  LEDCHIP-LED0603  [CHIP-LED0603]
LED5  Green  LEDCHIP-LED0603  [CHIP-LED0603]
MP1  MOUNT-PAD2.5  [P2.5]
MP2  MOUNT-PAD2.5  [P2.5]
MP3  MOUNT-PAD2.5  [P2.5]
MP4  MOUNT-PAD2.5  [P2.5]
R51  4k7  R-EU_R0603  [R0603]
R52  4k7  R-EU_R0603  [R0603]
R53  4k7  R-EU_R0603  [R0603]
R54  1k5  R-EU_R0603  [R0603]
R55  1k5  R-EU_R0603  [R0603]
TP1  TPB1,27  [B1,27]
TP2  TPB1,27  [B1,27]
TP5  TPB1,27  [B1,27]
U8  LT1767EMS8E-5PBF  [SOP65P490X110-9N]
U9  TC1264-3.3  [SOT230P700X180-4N]
X2  MSTBA2  [MSTBA2]

### Nets
+3V3 [supply]: C45.1 R54.2 TP5.TP U9.3(VOUT) ; also sheet 1,2,3,4
+5V [supply]: C43.+ C44.1 D2.A L2.2 R55.2 TP2.TP U8.6(FB) U9.1(VIN) ; also sheet 1,3,4
+24V: C40.1 D1.C F1.3 F1.4 R51.2 R52.2 TP1.TP U8.2(VIN) ; also sheet 3
GND [supply]: C40.2 C43.- C44.2 C45.2 D1.A D3.A LED3.C LED4.C R53.1 U8.4(GND_2) U8.8(SYNC) U8.9(GND) U9.2(GND) U9.4(GND_2) X2.2 ; also sheet 1,2,3,4
GND1 [supply]: LED5.C
N$43: C41.2 D2.C U8.1(BOOST)
N$44: LED3.A R52.1
N$45: LED2.C R51.1
N$47: C42.1 R53.2
N$48: C42.2 U8.7(VC)
N$49: C41.1 D3.C L2.1 U8.3(SW)
N$50: LED4.A R54.1
N$51: LED5.A R55.1
VIN: F1.1 F1.2 LED2.A X2.1
Unconnected: MP1.1 MP2.1 MP3.1 MP4.1 U8.5(~SHDN)

## Power pins joined to a net without a drawn wire
VBAT: U1.19(VBAT)
VREFN: U1.15(VREFN)

## Library data of the parts
C1 C2 C4 C6 C8-C38 C40-C42 C46-C54 = rcl:C-EU: CAPACITOR, European symbol
C3 C5 C7 C39 C43 = rcl:CPOL-EU: POLARIZED CAPACITOR, European symbol
C44 C45 = rcl:C-EU: CAPACITOR, European symbol; OC_FARNELL: unknown
D1 = diode:STPS3L40?; MP: STMICROELECTRONICS; MPN: STPS3L40UF; OC_FARNELL: 2341599
D2 = diode:CMDSH2-3
D3 = diode:USB120
F1 = fuse2:FUSE: Fuse
J1 J2 J11-J14 = con-molex:22-?-02: CONNECTOR wire to board 2.54 mm (.1 inch) pitch header; OC_FARNELL: 9731601; OC_NEWARK: unknown
J3 J4 = con-molex:22-?-04: CONNECTOR wire to board 2.54 mm (.1 inch) pitch header; OC_FARNELL: unknown; OC_NEWARK: unknown
J5 = con-amp:1241050-5
J6 J8 = Molex_By_element14_Batch_1:90814-0208: CONN HEADER 8POS 1.27MM SMD TIN; MPN: 90814-0208; OC_FARNELL: 1757025; OC_NEWARK: 34R6216; PACKAGE: CONN-8POS; SUPPLIER: Molex
J7 = Molex_By_element14_Batch_1:90814-0206: CONN HEADER 06 POS 1.27MM SMD TIN; MPN: 90814-0206; OC_FARNELL: 1757024; OC_NEWARK: 34R6215; PACKAGE: CONN-6 POS; SUPPLIER: Molex
J9 J10 = con-molex:22-?-03: CONNECTOR wire to board 2.54 mm (.1 inch) pitch header; OC_FARNELL: 9731610; OC_NEWARK: unknown
J15 = con-molex:22-?-05: CONNECTOR wire to board 2.54 mm (.1 inch) pitch header; OC_FARNELL: unknown; OC_NEWARK: unknown
K1-K4 = relay:G6K: Low Signal Relay oeiwcsnts1.omron.com/.. D20G6K0100.pdf; OC_FARNELL: 4484794; OC_NEWARK: unknown
L1 = coilcraft:0603PS
L2 = WE-PD:WE-PD: SMD-Shielded Power Inductors WE-PD - Magnetically shielded version which results in a low leakage field - High storage capacity - Low self-losses - Highest possible current loading for SMD-Inducors -- Switching regulators with low operating voltages (computer, laptop, mobile phones, pagers) -- Integrated DC/DC-converter -- Is recommended for the application with switching regulators from National Semiconductor, Linear Technology, Texas Instruments and Fairchild Semiconductor, ect. -- Graphic cards -- Plastic base: Because of the one piece construction these are more suitable for high vibration or shock applications; MPN: 7447713047; OC_FARNELL: 2082661; OC_NEWARK: 88T7091; PACKAGE: 1030; SUPPLIER: Wuerth Elektronik
LED1-LED3 = led:LED: LED OSRAM: - CHIPLED LG R971, LG N971, LY N971, LG Q971, LY Q971, LO R971, LY R971 LH N974, LH R974 LS Q976, LO Q976, LY Q976 LO Q996 - Hyper CHIPLED LW Q18S LB Q993, LB Q99A, LB R99A - SideLED LS A670, LO A670, LY A670, LG A670, LP A670 LB A673, LV A673, LT A673, LW A673 LH A674 LY A675 LS A676, LA A676, LO A676, LY A676, LW A676 LS A679, LY A679, LG A679 - Hyper Micro SIDELED® LS Y876, LA Y876, LO Y876, LY Y876 LT Y87S - SmartLED LW L88C, LW L88S LB L89C, LB L89S, LG L890 LS L89K, LO L89K, LY L89K LS L896, LA L896, LO L896, LY L896 - TOPLED LS T670, LO T670, LY T670, LG T670, LP T670 LSG T670, LSP T670, LSY T670, LOP T670, LYG T670 LG T671, LOG T671, LSG T671 LB T673, LV T673, LT T673, LW T673 LH T674 LS T676, LA T676, LO T676, LY T676, LB T676, LH T676, LSB T676, LW T676 LB T67C, LV T67C, LT T67C, LS T67K, LO T67K, LY T67K, LW E67C LS E67B, LA E67B, LO E67B, LY E67B, LB E67C, LV E67C, LT E67C LW T67C LS T679, LY T679, LG T679 LS T770, LO T770, LY T770, LG T770, LP T770 LB T773, LV T773, LT T773, LW T773 LH T774 LS E675, LA E675, LY E675, LS T675 LS T776, LA T776, LO T776, LY T776, LB T776 LHGB T686 LT T68C, LB T68C - Hyper Mini TOPLED® LB M676 - Mini TOPLED Santana® LG M470 LS M47K, LO M47K, LY M47K Source: http://www.osram.convergy.de LUXEON: - LUMILED® LXK2-PW12-R00, LXK2-PW12-S00, LXK2-PW14-U00, LXK2-PW14-V00 LXK2-PM12-R00, LXK2-PM12-S00, LXK2-PM14-U00 LXK2-PE12-Q00, LXK2-PE12-R00, LXK2-PE12-S00, LXK2-PE14-T00, LXK2-PE14-U00 LXK2-PB12-K00, LXK2-PB12-L00, LXK2-PB12-M00, LXK2-PB14-N00, LXK2-PB14-P00, LXK2-PB14-Q00 LXK2-PR12-L00, LXK2-PR12-M00, LXK2-PR14-Q00, LXK2-PR14-R00 LXK2-PD12-Q00, LXK2-PD12-R00, LXK2-PD12-S00 LXK2-PH12-R00, LXK2-PH12-S00 LXK2-PL12-P00, LXK2-PL12-Q00, LXK2-PL12-R00 Source: www.luxeon.com KINGBRIGHT: KA-3528ASYC Source: www.kingbright.com
LED4 LED5 = led:LED: LED OSRAM: - CHIPLED LG R971, LG N971, LY N971, LG Q971, LY Q971, LO R971, LY R971 LH N974, LH R974 LS Q976, LO Q976, LY Q976 LO Q996 - Hyper CHIPLED LW Q18S LB Q993, LB Q99A, LB R99A - SideLED LS A670, LO A670, LY A670, LG A670, LP A670 LB A673, LV A673, LT A673, LW A673 LH A674 LY A675 LS A676, LA A676, LO A676, LY A676, LW A676 LS A679, LY A679, LG A679 - Hyper Micro SIDELED® LS Y876, LA Y876, LO Y876, LY Y876 LT Y87S - SmartLED LW L88C, LW L88S LB L89C, LB L89S, LG L890 LS L89K, LO L89K, LY L89K LS L896, LA L896, LO L896, LY L896 - TOPLED LS T670, LO T670, LY T670, LG T670, LP T670 LSG T670, LSP T670, LSY T670, LOP T670, LYG T670 LG T671, LOG T671, LSG T671 LB T673, LV T673, LT T673, LW T673 LH T674 LS T676, LA T676, LO T676, LY T676, LB T676, LH T676, LSB T676, LW T676 LB T67C, LV T67C, LT T67C, LS T67K, LO T67K, LY T67K, LW E67C LS E67B, LA E67B, LO E67B, LY E67B, LB E67C, LV E67C, LT E67C LW T67C LS T679, LY T679, LG T679 LS T770, LO T770, LY T770, LG T770, LP T770 LB T773, LV T773, LT T773, LW T773 LH T774 LS E675, LA E675, LY E675, LS T675 LS T776, LA T776, LO T776, LY T776, LB T776 LHGB T686 LT T68C, LB T68C - Hyper Mini TOPLED® LB M676 - Mini TOPLED Santana® LG M470 LS M47K, LO M47K, LY M47K Source: http://www.osram.convergy.de LUXEON: - LUMILED® LXK2-PW12-R00, LXK2-PW12-S00, LXK2-PW14-U00, LXK2-PW14-V00 LXK2-PM12-R00, LXK2-PM12-S00, LXK2-PM14-U00 LXK2-PE12-Q00, LXK2-PE12-R00, LXK2-PE12-S00, LXK2-PE14-T00, LXK2-PE14-U00 LXK2-PB12-K00, LXK2-PB12-L00, LXK2-PB12-M00, LXK2-PB14-N00, LXK2-PB14-P00, LXK2-PB14-Q00 LXK2-PR12-L00, LXK2-PR12-M00, LXK2-PR14-Q00, LXK2-PR14-R00 LXK2-PD12-Q00, LXK2-PD12-R00, LXK2-PD12-S00 LXK2-PH12-R00, LXK2-PH12-S00 LXK2-PL12-P00, LXK2-PL12-Q00, LXK2-PL12-R00 Source: www.luxeon.com KINGBRIGHT: KA-3528ASYC Source: www.kingbright.com; MF: MULTICOMP; MPN: OVS-0604; OC_FARNELL: 1716771; OC_NEWARK: 15R2206
MP1-MP4 = holes:MOUNT-PAD: MOUNTING HOLE with drill center marker
P1 = con-wiznet:RB1-125BAG1A: Accessory RJ-45 With Transformer Connector - UDE
R1-R53 R56-R61 = rcl:R-EU_: RESISTOR, European symbol
R54 R55 = rcl:R-EU_: RESISTOR, European symbol; MF: MULTICOMP; MPN: MCMR06X1501FTL; OC_FARNELL: 2073391; OC_NEWARK: 58K4488
SJ1 SJ2 = SparkFun-Passives:SOLDERJUMPER: Solder Jumper Standard SMD solder jumper. Used to automate production. Two varients : Normally Open and Normally Closed are the same, but have different paste layers. NC will have a large amount of paste and should jumper during reflow.
SJ3 = jumper:SJ2W: SMD solder JUMPER
TP1 = testpad:TP: Test pad
TP2 TP5 = testpad:TP: Test pad; OC_FARNELL: unknown; OC_NEWARK: unknown
U1 = NXP:LPC1768FBD100; COPYRIGHT: Copyright C 2015 Accelerated Designs. All rights reserved; MANUFACTURER_PART_NUMBER: lpc1768fbd100; VENDOR: NXP
U2 U3 U11 = ti:SN74LVC3G17DCTR: TRIPLE SCHMITT-TRIGGER BUFFER; MPN: SN74LVC3G17DCTR; OC_FARNELL: 1236391; OC_NEWARK: 90H3713; PACKAGE: SSOP-8; SUPPLIER: Texas Instruments
U4 = ti:TPL0401
U5 = atmel:AT24C512C-SSHM-B: SERIAL EEPROM IC Memory Size:512Kbit,8-SOIC; MPN: AT24C02C-SSHM-B; OC_FARNELL: 1971995; OC_NEWARK: 68T4066; PACKAGE: 8SOIC; SUPPLIER: ATMEL
U6 U7 = ti:SN74LVC2G17DBVR: DUAL SCHMITT-TRIGGER BUFFER; MPN: SN74LVC2G17DBVR; OC_FARNELL: 1470776; OC_NEWARK: 76C4207; PACKAGE: SOT-23-6; SUPPLIER: Texas Instruments
U8 = lineartechnology:LT1767EMS8E-5PBF: Step-Down Switching Regulators; MPN: LT1767EMS8E-5#PBF; OC_FARNELL: 1663491; OC_NEWARK: 57M6275; PACKAGE: MSOP-8; SUPPLIER: Linear Technology
U9 = microchip-6:TC1264-3.3: IC, 8 00mA Fixed Output CMOS LDO,3.3V,SOT-223, 3-lead; OC_FARNELL: unknown; PACKAGE: SOT-223-3; SUPPLIER: Microchip
U$1 = exmachina:EXMACHINA-LOGO
U$2 = texas:DP83848JSQ/NOPB; COPYRIGHT: Copyright (C) 2015 Accelerated Designs. All rights reserved; MANUFACTURER_PART_NUMBER: dp83848jsqnopb; VENDOR: National Semiconductor
U$3 = crystal:ASE: 3.3Vdc CMOS SMD CRYSTAL CLOCK OSCILLATOR SOurce: www.abracon.com; OC_FARNELL: unknown; OC_NEWARK: unknown
U$4 = Microchip_By_element14_Batch_1:MCP2561-E/SN: High-Speed CAN Transceiver; MPN: MCP2551-I/SN; PACKAGE: SOIC-8; SUPPLIER: Microchip
U$5 = con-multicomp:5504F1-09S-02A-03: D-Sub 9pts, Righ-angle, solder
U$6 = con-GlobalConnectorTechnology:USB3075-30-A
X1 = crystal:FC-135: 32.768kHz ±20ppm Crystal 12.5pF 70 kOhm -40°C ~ 85°C Surface Mount 2-SMD
X2 = con-phoenix-508:MSTBA2: PHOENIX; MF: FARNELL; MPN: 1757242; OC_FARNELL: 3705171; OC_NEWARK: 71C4161

## Net classes
1 signal: width 0.178 mm, drill 0.35 mm
2 supply: width 0.406 mm, drill 0.5 mm

## Board
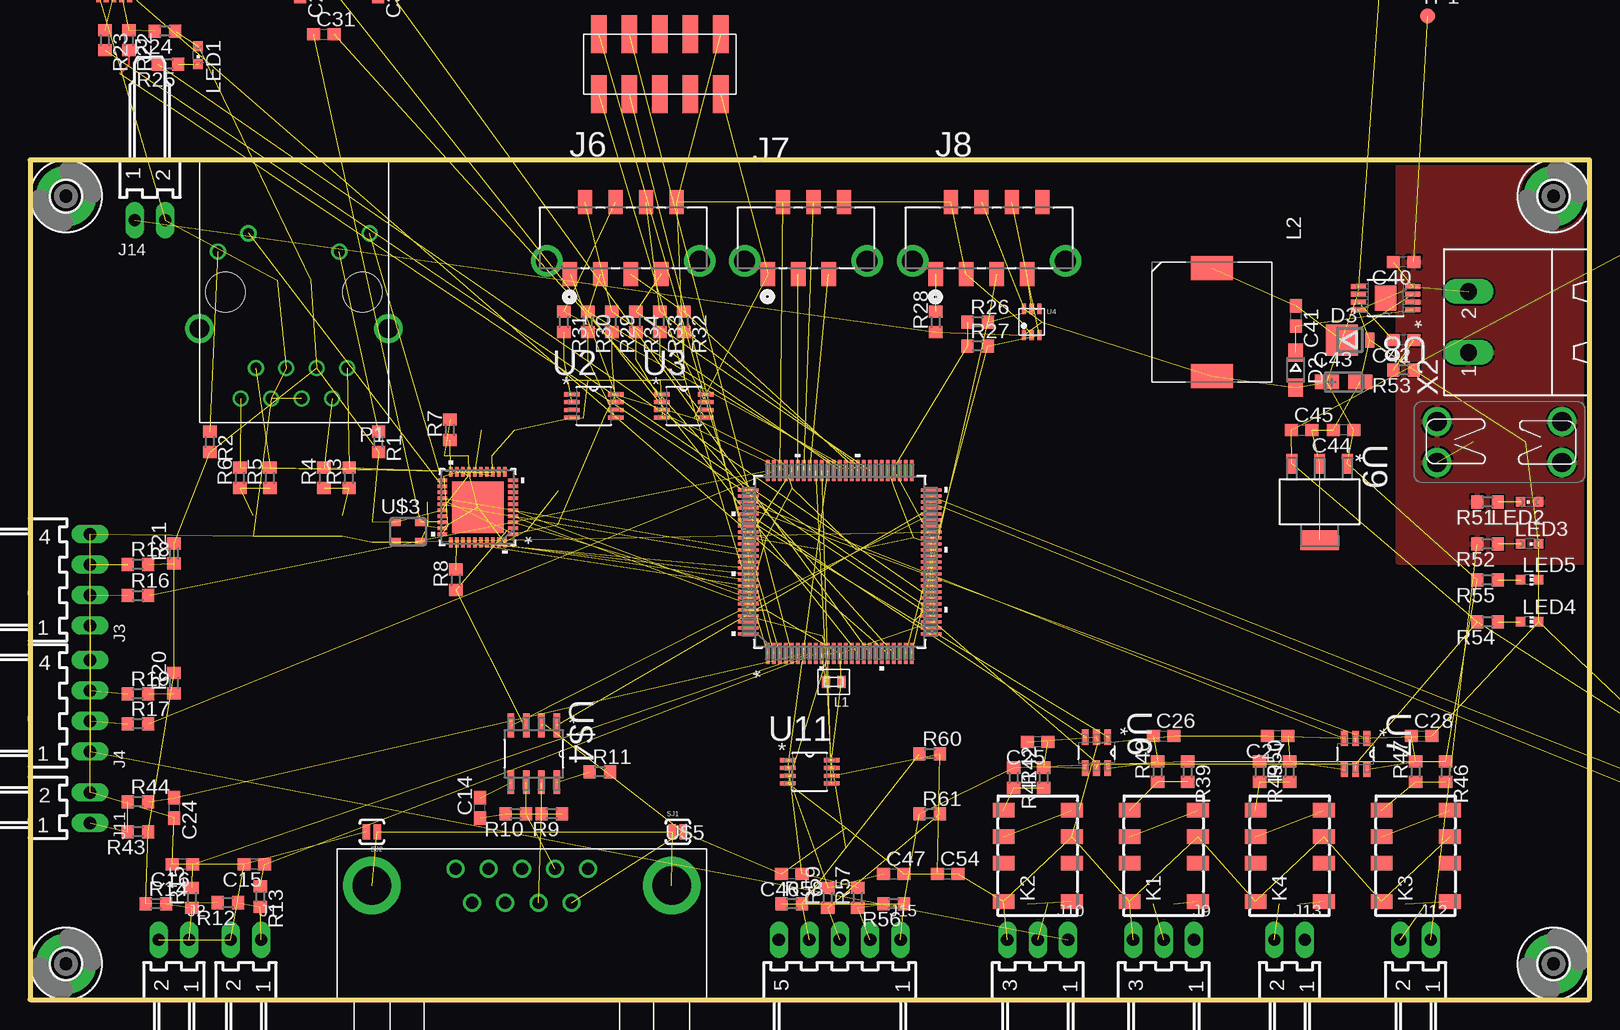
[diagram p5: board, top side]
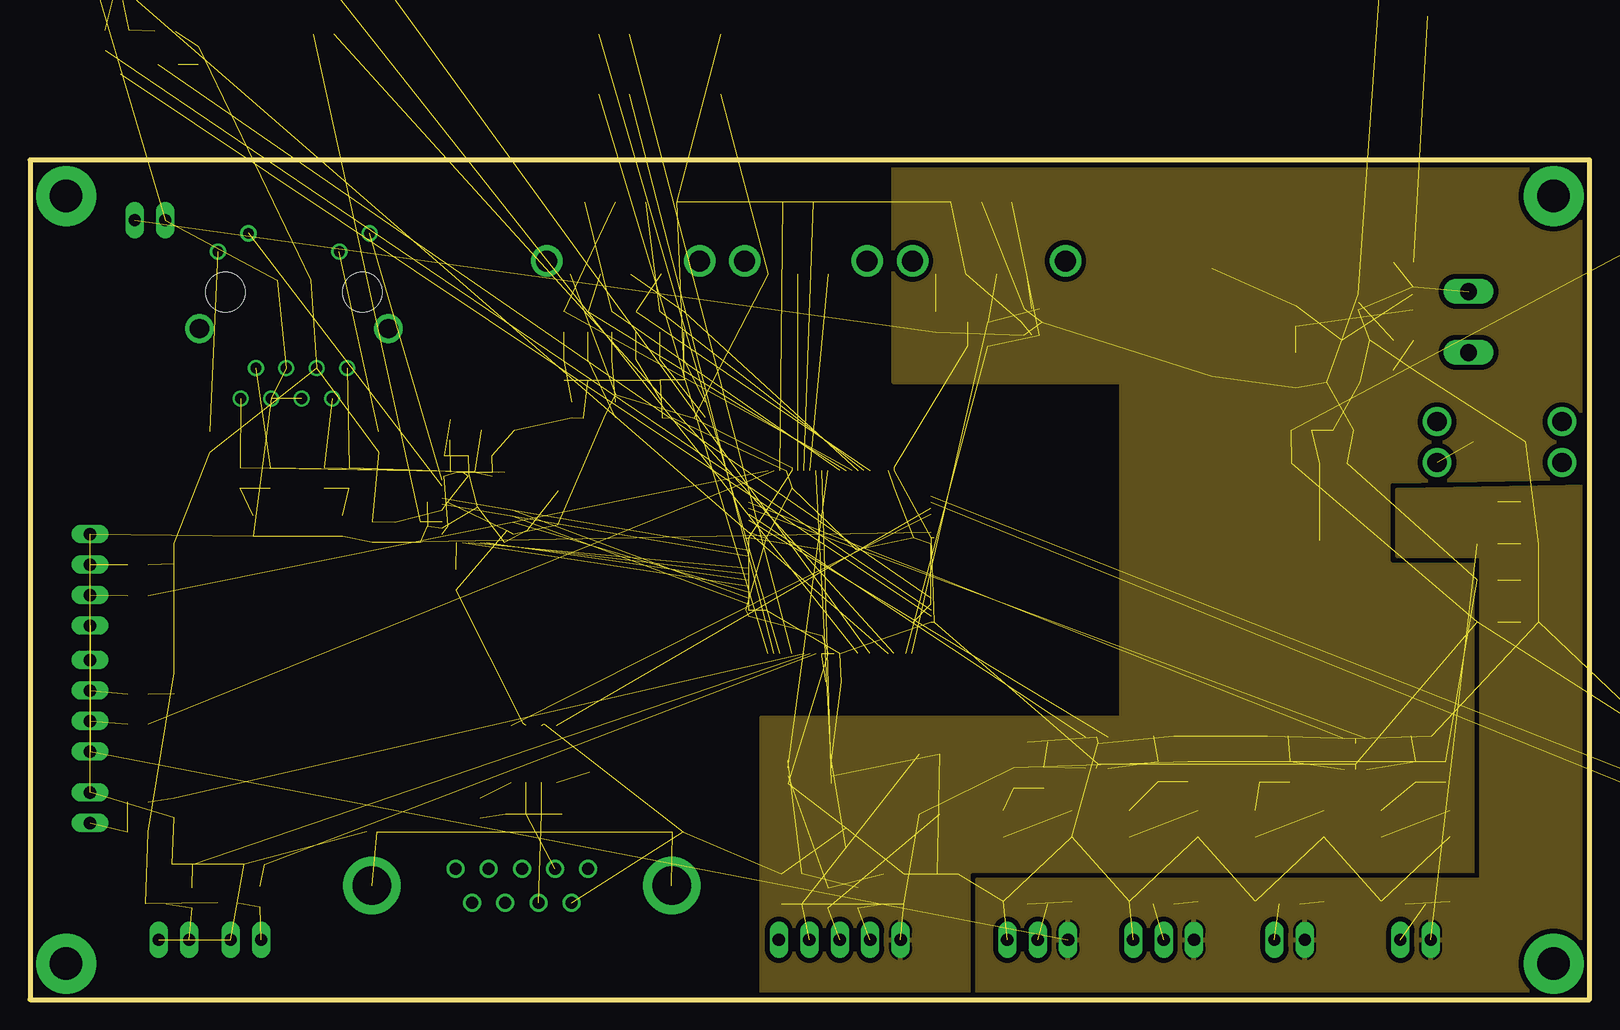
[diagram p6: board, inner layer Route3]
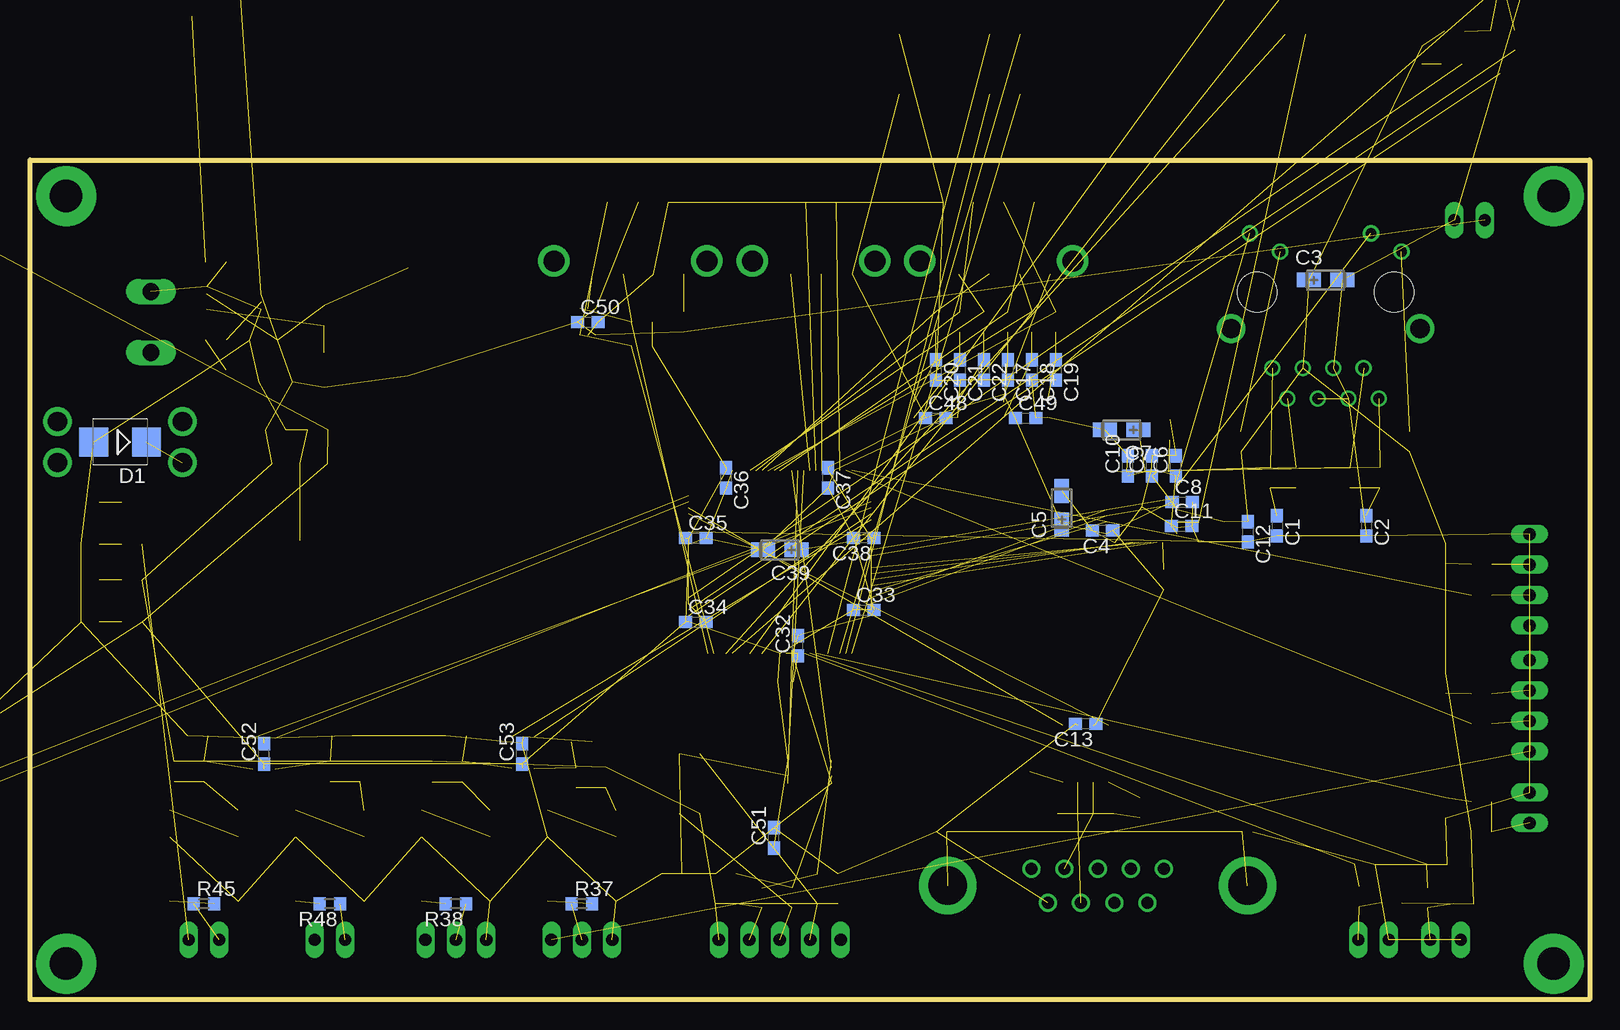
[diagram p7: board, bottom side, seen from below]

Size 130 x 70 mm. Coordinates in mm from the lower left corner, seen from the top.
Outline: 0,0 130,0 130,70 0,70 0,0
Copper layers (1+2*3+16): Top 0.018mm / dielectric 0.36mm / Route2 0.035mm / dielectric 0.71mm / Route3 0.035mm / dielectric 0.36mm / Bottom 0.018mm
Design rules "eC_4Layer_PClass6_BaseCopperO18-I35_eCDefault *": minimum track width 0.15mm, minimum drill 0.35mm, track to track 0.15mm, track to pad 0.15mm, pad to pad 0.15mm, via to via 0.15mm, smd to smd 0mil, copper to edge 0.25mm, drill to drill 0.35mm, minimum pad ring 0.175mm, minimum via ring 0.125mm, stop-mask expansion 0mil, vias tented up to drill 0.45mm, thermal gap 0.2mm

### Footprints (pad centres in the part's own frame; a part is rotated, then mirrored left to right if it is on the bottom)
C0603 = smd 1.1 x 1: 1 -0.85,0; 2 0.85,0
CT3216 = smd 2 x 1.2: + -1.4,0; - 1.4,0
SMB = smd 2.4 x 2.4: A 2.2,0; C -2.2,0
SOD323-W = smd 1.5 x 1.2: A 1.45,0; C -1.45,0
DO216AA = smd 0.76 x 1.27: A 0.7,0 | smd 2.67 x 2.574: C -1.665,0
3557-LITTLE = drill 1.6: 1 -5.207,-1.702; 2 -5.207,1.702; 3 5.207,-1.702; 4 5.207,1.702
7395-02 = drill 1.016 long: 1 1.27,0; 2 -1.27,0
7395-04 = drill 1.016 long: 1 3.81,0; 2 1.27,0; 3 -1.27,0; 4 -3.81,0
2.54/2X5 = smd 1.27 x 3.2: 1 -5.08,2.5; 2 -5.08,-2.5; 3 -2.54,2.5; 4 -2.54,-2.5; 5 0,2.5; 6 0,-2.5; 7 2.54,2.5; 8 2.54,-2.5; 9 5.08,2.5; 10 5.08,-2.5
MOLEX_90814-0208 = smd 1.194 x 2.007: 1 0,0; 2 1.27,5.994; 3 2.54,0; 4 3.81,5.994; 5 5.08,0; 6 6.35,5.994; 7 7.62,0; 8 8.89,5.994 | drill 1.753: 9 -1.93,1.092; 10 10.82,1.092
MOLEX_90814-0206 = smd 1.194 x 2.007: 1 0,0; 2 1.27,5.994; 3 2.54,0; 4 3.81,5.994; 5 5.08,0; 6 6.35,5.994 | drill 1.753: 7 -1.93,1.092; 8 8.28,1.092
7395-03 = drill 1.016 long: 1 2.54,0; 2 0,0; 3 -2.54,0
7395-05 = drill 1.016 long: 1 5.08,0; 2 2.54,0; 3 0,0; 4 -2.54,0; 5 -5.08,0
G6K-2G-Y = smd 1.2 x 1.8: 1 -3.8,-2.85; 2 -0.6,-2.85; 3 1.6,-2.85; 4 3.8,-2.85; 5 3.8,2.85; 6 1.6,2.85; 7 -0.6,2.85; 8 -3.8,2.85
0603 = smd 0.64 x 1.02: P$1 -0.64,0; P$2 0.64,0
WE-PD_1030/1050 = smd 2 x 3.5: 1 -4.5,0; 2 4.5,0
CHIPLED_0603 = smd 0.8 x 0.8: A 0,-0.75; C 0,0.75
CHIP-LED0603 = smd 0.8 x 0.8: A 0,-0.75; C 0,0.75
P2.5 = drill 2.7 pad 5: 1 0,0
WIZNET_RB1-125BAG1A = drill 0.9: L1 6.325,-3.38; L2 3.784,-4.899; L3 -3.786,-3.379; L4 -6.325,-4.9 | drill 0.9 pad 1.3: R1 -4.446,6.349; R2 -3.176,8.889; R3 -1.906,6.349; R4 -0.636,8.889; R5 0.634,6.349; R6 1.904,8.889; R7 3.174,6.349; R8 4.444,8.889 | drill 1.6 pad 2.184: S1 -7.876,3.049; S2 7.874,3.049 | hole 3.3: 5.714,-0.001; -5.716,-0.001
R0603 = smd 1 x 1.1: 1 -0.85,0; 2 0.85,0
SJ_2S-NO = smd 0.635 x 1.27: 1 -0.45,0; 2 0.45,0
SJ_2 = smd 1.168 x 1.6: 1 -1.524,0; 2 0,0; 3 1.524,0
B1,27 = smd 1.27 x 1.27: TP 0,0
SOT407-1 = smd 1.727 x 0.279: 1 -7.62,6; 2 -7.62,5.5; 3 -7.62,5; 4 -7.62,4.5; 5 -7.62,4; 6 -7.62,3.5; 7 -7.62,3; 8 -7.62,2.5; 9 -7.62,2; 10 -7.62,1.5; 11 -7.62,1; 12 -7.62,0.5; 13 -7.62,0; 14 -7.62,-0.5; 15 -7.62,-1; 16 -7.62,-1.5; 17 -7.62,-2; 18 -7.62,-2.5; 19 -7.62,-3; 20 -7.62,-3.5; 21 -7.62,-4; 22 -7.62,-4.5; 23 -7.62,-5; 24 -7.62,-5.5; 25 -7.62,-6; 51 7.62,-6; 52 7.62,-5.5; 53 7.62,-5; 54 7.62,-4.5; 55 7.62,-4; 56 7.62,-3.5; 57 7.62,-3; 58 7.62,-2.5; 59 7.62,-2; 60 7.62,-1.5; 61 7.62,-1; 62 7.62,-0.5; 63 7.62,0; 64 7.62,0.5; 65 7.62,1; 66 7.62,1.5; 67 7.62,2; 68 7.62,2.5; 69 7.62,3; 70 7.62,3.5; 71 7.62,4; 72 7.62,4.5; 73 7.62,5; 74 7.62,5.5; 75 7.62,6 | smd 0.279 x 1.727: 26 -6,-7.62; 27 -5.5,-7.62; 28 -5,-7.62; 29 -4.5,-7.62; 30 -4,-7.62; 31 -3.5,-7.62; 32 -3,-7.62; 33 -2.5,-7.62; 34 -2,-7.62; 35 -1.5,-7.62; 36 -1,-7.62; 37 -0.5,-7.62; 38 0,-7.62; 39 0.5,-7.62; 40 1,-7.62; 41 1.5,-7.62; 42 2,-7.62; 43 2.5,-7.62; 44 3,-7.62; 45 3.5,-7.62; 46 4,-7.62; 47 4.5,-7.62; 48 5,-7.62; 49 5.5,-7.62; 50 6,-7.62; 76 6,7.62; 77 5.5,7.62; 78 5,7.62; 79 4.5,7.62; 80 4,7.62; 81 3.5,7.62; 82 3,7.62; 83 2.5,7.62; 84 2,7.62; 85 1.5,7.62; 86 1,7.62; 87 0.5,7.62; 88 0,7.62; 89 -0.5,7.62; 90 -1,7.62; 91 -1.5,7.62; 92 -2,7.62; 93 -2.5,7.62; 94 -3,7.62; 95 -3.5,7.62; 96 -4,7.62; 97 -4.5,7.62; 98 -5,7.62; 99 -5.5,7.62; 100 -6,7.62
SOP65P400X130-8N = smd 1.321 x 0.356: 1 -1.829,0.965; 2 -1.829,0.33; 3 -1.829,-0.33; 4 -1.829,-0.965; 5 1.829,-0.965; 6 1.829,-0.33; 7 1.829,0.33; 8 1.829,0.965
SC-70-DCK = smd 0.35 x 0.85: 1 -0.65,-1.1; 2 0,-1.1; 3 0.65,-1.1; 4 0.65,1.1; 5 0,1.1; 6 -0.65,1.1
SOIC127P600X175-8N = smd 2.184 x 0.559: 1 -2.362,1.905; 2 -2.362,0.635; 3 -2.362,-0.635; 4 -2.362,-1.905; 5 2.362,-1.905; 6 2.362,-0.635; 7 2.362,0.635; 8 2.362,1.905
SOT95P280X145-6N = smd 1.27 x 0.559: 1 -1.295,0.94; 2 -1.295,0; 3 -1.295,-0.94; 4 1.295,-0.94; 5 1.295,0; 6 1.295,0.94
SOP65P490X110-9N = smd 1.245 x 0.432: 1 -2.261,0.965; 2 -2.261,0.33; 3 -2.261,-0.33; 4 -2.261,-0.965; 5 2.261,-0.965; 6 2.261,-0.33; 7 2.261,0.33; 8 2.261,0.965 | smd 1.829 x 2.057: 9 0,0
SOT230P700X180-4N = smd 1.626 x 0.889: 1 -3.2,2.311; 2 -3.2,0; 3 -3.2,-2.311 | smd 1.626 x 3.175: 4 3.2,0
SQA40B = smd 0.813 x 0.305: 1 -2.946,2.25; 2 -2.946,1.75; 3 -2.946,1.25; 4 -2.946,0.75; 5 -2.946,0.25; 6 -2.946,-0.25; 7 -2.946,-0.75; 8 -2.946,-1.25; 9 -2.946,-1.75; 10 -2.946,-2.25; 21 2.946,-2.25; 22 2.946,-1.75; 23 2.946,-1.25; 24 2.946,-0.75; 25 2.946,-0.25; 26 2.946,0.25; 27 2.946,0.75; 28 2.946,1.25; 29 2.946,1.75; 30 2.946,2.25 | smd 0.305 x 0.813: 11 -2.25,-2.946; 12 -1.75,-2.946; 13 -1.25,-2.946; 14 -0.75,-2.946; 15 -0.25,-2.946; 16 0.25,-2.946; 17 0.75,-2.946; 18 1.25,-2.946; 19 1.75,-2.946; 20 2.25,-2.946; 31 2.25,2.946; 32 1.75,2.946; 33 1.25,2.946; 34 0.75,2.946; 35 0.25,2.946; 36 -0.25,2.946; 37 -0.75,2.946; 38 -1.25,2.946; 39 -1.75,2.946; 40 -2.25,2.946 | smd 4.3 x 4.3: 41 0,0
ASE = smd 0.9 x 0.65: 1 -1.05,-0.825; 2 1.05,-0.825; 3 1.05,0.825; 4 -1.05,0.825
SOIC127P600X175-8N' = smd 1.981 x 0.559: 1 -2.362,1.905; 2 -2.362,0.635; 3 -2.362,-0.635; 4 -2.362,-1.905; 5 2.362,-1.905; 6 2.362,-0.635; 7 2.362,0.635; 8 2.362,1.905
5504F1-09S-02A = drill 1: 1 -5.54,-1.42; 2 -2.77,-1.42; 3 0,-1.42; 4 2.77,-1.42; 5 5.54,-1.42; 6 -4.155,1.42; 7 -1.385,1.42; 8 1.385,1.42; 9 4.155,1.42 | drill 3.2: G1 -12.495,0; G2 12.495,0
USB_MICROB_SMT = smd 0.4 x 1.4: 1 -1.3,2.65; 2 -0.65,2.65; 3 0,2.65; 4 0.65,2.65; 5 1.3,2.65 | smd 1.15 x 1.45: 7 -2.7,2.23; 8 2.8,2.23 | smd 1.75 x 1.9: 9 -1.125,0; 10 1.125,0 | drill 1.25 pad 1.9: 11 -3.575,0; 12 3.575,0
FC-135 = smd 1 x 1.8: 1 -1.25,0; 2 1.25,0
MSTBA2 = drill 1.397 long: 1 -2.54,5.08; 2 2.54,5.08

### Placement (x,y rotation side)
C1  26.05,39.5 270 bottom
C2  18.6,39.5 270 bottom
C3  22,60 0 bottom
C4  40.6,39.1 180 bottom
C5  44,41 90 bottom
C6  34.5,44.5 90 bottom
C7  39,47.5 180 bottom
C8  33.95,41.5 0 bottom
C9  36.5,44.5 90 bottom
C10  38.5,44.5 90 bottom
C11  34,39.5 0 bottom
C12  28.5,39 270 bottom
C13  42,23 180 bottom
C14  37.5,16 90 top
C15  18.7,11.3 180 top
C16  12.7,11.3 180 top
C17  48.5,52.5 270 bottom
C18  46.5,52.5 270 bottom
C19  44.5,52.5 270 bottom
C20  54.5,52.5 270 bottom
C21  52.5,52.5 270 bottom
C22  50.5,52.5 270 bottom
C23  144,16 0 bottom  (outside the outline)
C24  12,16 270 top
C25  84,21.5 180 top
C26  94.5,22 0 top
C27  104,22 180 top
C28  116,22 0 top
C29  22.5,84.5 270 top  (outside the outline)
C30  29,84.5 270 top  (outside the outline)
C31  24.5,80.5 0 top  (outside the outline)
C32  66,29.5 90 bottom
C33  60.5,32.5 0 bottom
C34  74.5,31.5 0 bottom
C35  74.5,38.5 0 bottom
C36  72,43.5 270 bottom
C37  63.5,43.5 270 bottom
C38  60.5,38.5 180 bottom
C39  67.5,37.5 180 bottom
C40  114.5,61.5 180 top
C41  105.5,57 270 top
C42  114.5,55 180 top
C43  109.5,51.5 0 top
C44  109.5,47.5 180 top
C45  106,47.5 0 top
C46  63.5,10.5 180 top
C47  72,10.5 0 top
C48  54.5,48.5 0 bottom
C49  47,48.5 0 bottom
C50  83.5,56.5 0 bottom
C51  68,13.5 90 bottom
C52  110.5,20.5 90 bottom
C53  89,20.5 90 bottom
C54  76.5,10.5 0 top
D1  122.5,46.5 180 bottom
D2  105.5,52.5 270 top
D3  111,55 0 top
F1  122.5,46.5 180 top
J1  18,5 0 top
J2  12,5 0 top
J3  5,35 270 top
J4  5,24.5 270 top
J5  52.5,78 180 top  (outside the outline)
J6  45,60.5 0 top
J7  61.5,60.5 0 top
J8  75.5,60.5 0 top
J9  94.5,5 0 top
J10  84,5 0 top
J11  5,16 270 top
J12  115.5,5 0 top
J13  105,5 0 top
J14  10,65 180 top
J15  67.5,5 0 top
K1  94.5,12 90 top
K2  84,12 90 top
K3  115.5,12 90 top
K4  105,12 90 top
L1  67,26.5 180 top
L2  98.5,56.5 270 top
LED1  14,78.75 180 top  (outside the outline)
LED2  125,41.5 90 top
LED3  125,38 270 top
LED4  125,31.5 270 top
LED5  125,35 270 top
MP1  3,67 0 top
MP2  127,67 0 top
MP3  3,3 0 top
MP4  127,3 0 top
P1  22,59 180 top
R1  29.05,46.5 270 top
R2  15,46.5 270 top
R3  26.6,43.5 90 top
R4  24.5,43.5 90 top
R5  20,43.5 90 top
R6  17.5,43.5 90 top
R7  35,47.5 90 top
R8  35.5,35 90 top
R9  43.5,15.5 180 top
R10  40.5,15.5 180 top
R11  47.5,19 0 top
R12  16.5,8.1 180 top
R13  19.2,8.6 270 top
R14  10.5,8 0 top
R15  13.5,8.5 90 top
R16  9,33.7 0 top
R17  9,23 0 top
R18  9,36.3 0 top
R19  9,25.5 0 top
R20  12,26.4 90 top
R21  12,37.2 90 top
R22  8.25,80 270 top  (outside the outline)
R23  6.25,80 270 top  (outside the outline)
R24  11.25,80.75 180 top  (outside the outline)
R25  11.5,78 180 top  (outside the outline)
R26  79,56.5 0 top
R27  79,54.5 0 top
R28  75.5,56.5 90 top
R29  48.5,56.5 270 top
R30  46.5,56.5 270 top
R31  44.5,56.5 270 top
R32  54.5,56.5 270 top
R33  52.5,56.5 270 top
R34  50.5,56.5 270 top
R35  149,10 0 top  (outside the outline)
R36  149,7.5 0 top  (outside the outline)
R37  84,8 0 bottom
R38  94.5,8 180 bottom
R39  96.5,19 270 top
R40  94,19 90 top
R41  82,18.5 270 top
R42  84.5,18.5 90 top
R43  9,14 180 top
R44  9,16.5 0 top
R45  115.5,8 0 bottom
R46  118,19 270 top
R47  115.5,19 90 top
R48  105,8 180 bottom
R49  102.5,19 270 top
R50  105,19 90 top
R51  121.5,41.5 180 top
R52  121.5,38 180 top
R53  114.5,52.5 180 top
R54  121.5,31.5 180 top
R55  121.5,35 180 top
R56  72,8 180 top
R57  69,8.5 90 top
R58  63.5,8 0 top
R59  66.5,8.5 90 top
R60  75,20.5 0 top
R61  75,15.5 0 top
SJ1  54,14 0 top
SJ2  28.5,14 180 top
SJ3  150.5,16 90 top  (outside the outline)
TP1  116.5,82 0 top  (outside the outline)
TP2  113,91.5 90 top  (outside the outline)
TP5  138,65 90 top  (outside the outline)
U1  67.5,36.5 90 top
U2  47,49.5 0 top
U3  54.5,49.5 0 top
U4  83.5,56.5 0 top
U5  144,14.5 0 top  (outside the outline)
U6  88.9,20.6 270 top
U7  110.5,20.5 270 top
U8  113,58.5 180 top
U9  107.5,41.5 270 top
U11  65,19 0 top
U$1  178.61,1.49 0 top  (outside the outline)
U$2  37.32,41.07 180 top
U$3  31.5,39 0 top
U$4  MCP2561-E/SN  [SOIC127P600X175-8N']  42,20.5 270 top
U$5  41,9.5 180 top
U$6  7,86.5 180 top  (outside the outline)
X1  25.5,85.5 0 top  (outside the outline)
X2  125,56.5 90 top

### Tracks (layer width: path | path; a pad name or v marks a point on that pad's centre or on a via)
+3V3  (61 unrouted)
+5V  (21 unrouted)
  pour Route3 (isolate 0.406, rank 2): 72,70.5 137.5,70.5 137.5,34.5 137.5,-8.5 82,-8.5 61,-8.5 61,23.5 91,23.5 91,51.5 72,51.5
+24V  (5 unrouted)
  pour Route3 (isolate 0.406): 142,-1.5 79,-1.5 79,10 121,10 121,37 114,37 114,42.5 142,43
  pour Top: 114,36.5 132.5,36.5 132.5,71.5 114,71.5
ADC_SLACK_DETECTION  (2 unrouted)
ADC_TEMP_0  (2 unrouted)
ADC_TEMP_1  (2 unrouted)
AVDD  (3 unrouted)
BRAKE_SENSOR_1  (1 unrouted)
BRAKE_SENSOR_2  (1 unrouted)
CAN_H  (2 unrouted)
CAN_L  (2 unrouted)
CAN_RX  (1 unrouted)
CAN_SPLIT  (1 unrouted)
CAN_TX  (1 unrouted)
DRIVE_EN  (1 unrouted)
DRIVE_ERR  (1 unrouted)
EEPROM_SCL  (2 unrouted)
EEPROM_SDA  (2 unrouted)
ENCODER_A  (1 unrouted)
ENCODER_B  (1 unrouted)
ENCODER_Z  (1 unrouted)
ETH_CLK_EN  (1 unrouted)
ETH_CRS  (1 unrouted)
ETH_MDC  (1 unrouted)
ETH_MDIO  (1 unrouted)
ETH_RX_ER  (1 unrouted)
ETH_RX_N  (2 unrouted)
ETH_RX_P  (2 unrouted)
ETH_RXD_N  (1 unrouted)
ETH_RXD_P  (1 unrouted)
ETH_TX_N  (2 unrouted)
ETH_TX_P  (2 unrouted)
ETH_TXD_EN  (1 unrouted)
ETH_TXD_N  (1 unrouted)
ETH_TXD_P  (1 unrouted)
ETH_X1  (2 unrouted)
FAN_1_PWM  (1 unrouted)
FAN_1_SENSOR  (1 unrouted)
FAN_2_PWM  (1 unrouted)
FAN_2_SENSOR  (1 unrouted)
GND  (114 unrouted)
HMI_BUTTON_1  (2 unrouted)
HMI_BUTTON_2  (2 unrouted)
HMI_BUTTON_3  (2 unrouted)
HMI_BUTTON_4  (2 unrouted)
HMI_BUTTON_5  (2 unrouted)
HMI_BUTTON_6  (2 unrouted)
HMI_LCD_LED+  (1 unrouted)
HMI_LCD_SCL  (3 unrouted)
HMI_LCD_SDA  (3 unrouted)
HMI_LCD_VO  (1 unrouted)
HMI_LED_1  (1 unrouted)
HMI_LED_2  (1 unrouted)
HMI_LED_3  (1 unrouted)
HMI_LED_4  (1 unrouted)
JTAG_TCK  (1 unrouted)
JTAG_TDI  (1 unrouted)
JTAG_TDO  (1 unrouted)
JTAG_TMS  (1 unrouted)
L1_1  (1 unrouted)
L1_2  (1 unrouted)
MII_MODE  (1 unrouted)
N$1  (2 unrouted)
N$2  (2 unrouted)
N$3  (2 unrouted)
N$4  (1 unrouted)
N$5  (1 unrouted)
N$6  (3 unrouted)
N$7  (2 unrouted)
N$8  (1 unrouted)
N$9  (1 unrouted)
N$10  (2 unrouted)
N$11  (1 unrouted)
N$12  (1 unrouted)
N$13  (1 unrouted)
N$14  (1 unrouted)
N$15  (2 unrouted)
N$16  (1 unrouted)
N$17  (2 unrouted)
N$18  (1 unrouted)
N$19  (2 unrouted)
N$20  (2 unrouted)
N$21  (1 unrouted)
N$22  (1 unrouted)
N$23  (1 unrouted)
N$24  (1 unrouted)
N$25  (2 unrouted)
N$26  (2 unrouted)
N$27  (2 unrouted)
N$28  (1 unrouted)
N$29  (1 unrouted)
N$30  (2 unrouted)
N$31  (2 unrouted)
N$32  (1 unrouted)
N$33  (1 unrouted)
N$34  (2 unrouted)
N$35  (2 unrouted)
N$36  (2 unrouted)
N$37  (1 unrouted)
N$38  (2 unrouted)
N$39  (2 unrouted)
N$40  (2 unrouted)
N$41  (2 unrouted)
N$42  (2 unrouted)
N$43  (2 unrouted)
N$44  (1 unrouted)
N$45  (1 unrouted)
N$46  (2 unrouted)
N$47  (1 unrouted)
N$48  (1 unrouted)
N$49  (3 unrouted)
N$50  (1 unrouted)
N$51  (1 unrouted)
N$52  (2 unrouted)
N$53  (2 unrouted)
N$54  (2 unrouted)
N$55  (1 unrouted)
N$57  (1 unrouted)
N$58  (2 unrouted)
N$59  (1 unrouted)
N$60  (1 unrouted)
PFBOUT  (6 unrouted)
RTCX1  (2 unrouted)
RTCX2  (2 unrouted)
USB_D_N  (1 unrouted)
USB_D_P  (1 unrouted)
  Top 0.15: 7.5,77.21 8.25,77.96 R22.2
USB_UP_LED  (1 unrouted)
USB_V_BUS  (1 unrouted)
VIN
  pour Top: 122.5,40 133,40 133,63.5 118,63.5 118,50 122.5,50
XTAL1  (1 unrouted)